# Altium project PLC1.PrjPcb (part 1 of 2)
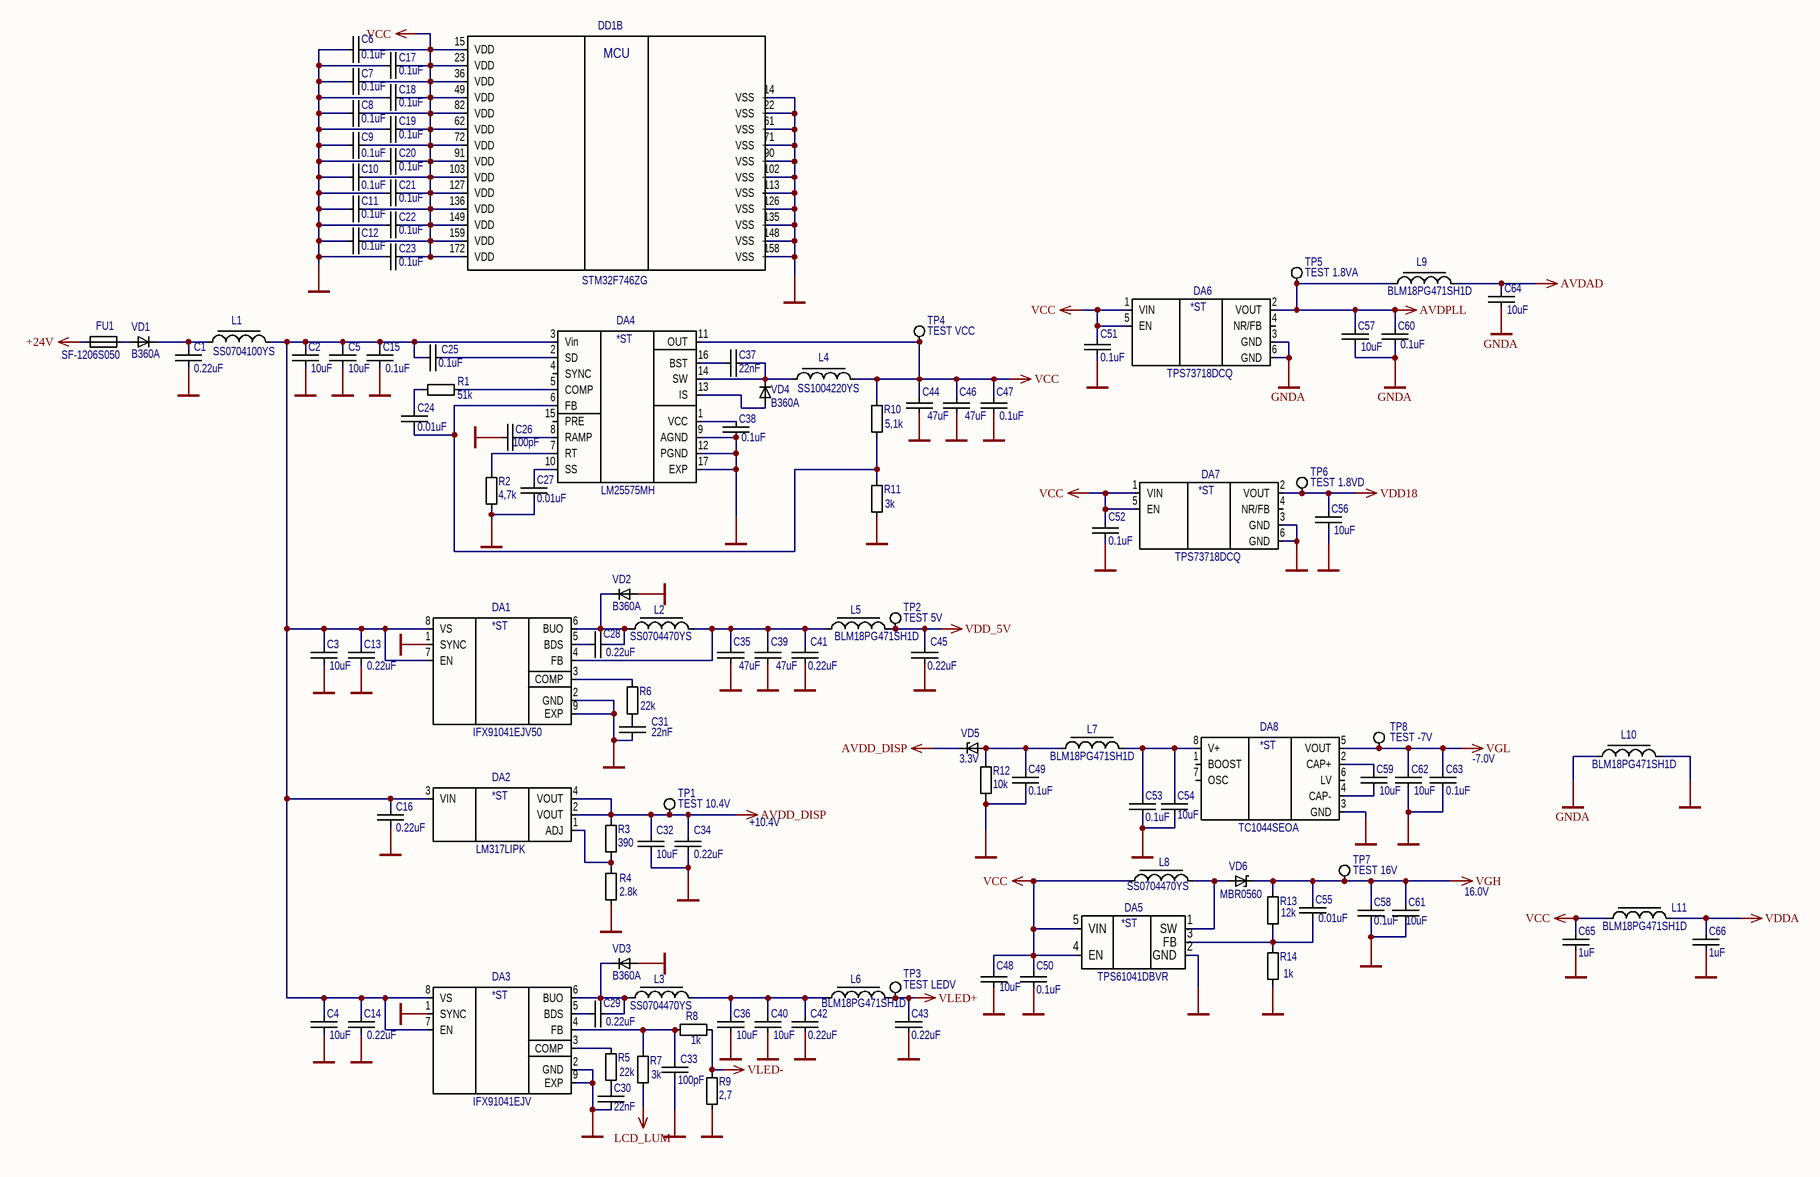
[diagram p0: PLC1.SchDoc]
4 sheets, 347 parts. Net scope: global (net labels, ports and power ports of the same name join across sheets).
Board file: PLC1.PcbDoc
Sheets:
  PLC1.SchDoc
  PLC1_2.SchDoc
  PLC1_3.SchDoc
  PLC1_4.SchDoc

## Sheet PLC1.SchDoc
size 420 x 297 mm; Author: Тертычный; DrawnBy: Тертычный; SheetNumber: 1; SheetTotal: 2; Scale: {Масш.}; Title1str: {Наименование}; PageSetup: Record=PageOptions|CenterHorizontal=False|CenterVertical=False|PrintScale=0.67|XCorrection=0.00|YCorrection=0.00|PrintKind=1|BorderSize=5000000|LeftOffset=0|BottomOffset=0|Orientation=2|PaperLength=2970|PaperWidth=2100|Scale=100|PaperSource=7|PrintQuality=600|MediaType=1|DitherType=10|PaperKind=A4|PrintScaleMode=1; Title2str: {Наименование}; Mass: {Масса}; Letter1Column: {}; Letter2Column: {}; Letter3Column: {}; DocumentType: Панель индикации; DocumentType1str: {Документ}; DocumentType2str: {Документ}

### Parts
C1  value 0.22uF  [C_0805]  (hidden comment: Cap_0805)
C2  value 10uF  [CAP1210]  (hidden comment: Cap_1210)
C3  value 10uF  [CAP1210]  (hidden comment: Cap_1210)
C4  value 10uF  [CAP1210]  (hidden comment: Cap_1210)
C5  value 10uF  [CAP1210]  (hidden comment: Cap_1210)
C6  0.1uF  [CAP_0603]
C7  0.1uF  [CAP_0603]
C8  0.1uF  [CAP_0603]
C9  0.1uF  [CAP_0603]
C10  0.1uF  [CAP_0603]
C11  0.1uF  [CAP_0603]
C12  0.1uF  [CAP_0603]
C13  value 0.22uF  [C_0805]  (hidden comment: Cap_0805)
C14  value 0.22uF  [C_0805]  (hidden comment: Cap_0805)
C15  0.1uF  [C_0805]
C16  value 0.22uF  [C_0805]  (hidden comment: Cap_0805)
C17  0.1uF  [CAP_0603]
C18  0.1uF  [CAP_0603]
C19  0.1uF  [CAP_0603]
C20  0.1uF  [CAP_0603]
C21  0.1uF  [CAP_0603]
C22  0.1uF  [CAP_0603]
C23  0.1uF  [CAP_0603]
C24  0.01uF  [CAP_0603]
C25  0.1uF  [C_0805]
C26  value 100pF  [CAP_0603]  (hidden comment: 100p)
C27  value 0.01uF  [CAP_0603]  (hidden comment: 0.1uF)
C28  value 0.22uF  [C_0805]  (hidden comment: Cap_0805)
C29  value 0.22uF  [C_0805]  (hidden comment: Cap_0805)
C30  22nF  [CAP_0603]
C31  22nF  [CAP_0603]
C32  value 10uF  [CAP1210]  (hidden comment: Cap_1210)
C33  value 100pF  [CAP_0603]  (hidden comment: 100p)
C34  value 0.22uF  [C_0805]  (hidden comment: Cap_0805)
C35  value 47uF  [CAP1206]  (hidden comment: 1206)
C36  value 10uF  [CAP1210]  (hidden comment: Cap_1210)
C37  22nF  [CAP_0603]
C38  0.1uF  [CAP_0603]
C39  value 47uF  [CAP1206]  (hidden comment: 1206)
C40  value 10uF  [CAP1210]  (hidden comment: Cap_1210)
C41  value 0.22uF  [C_0805]  (hidden comment: Cap_0805)
C42  value 0.22uF  [C_0805]  (hidden comment: Cap_0805)
C43  value 0.22uF  [C_0805]  (hidden comment: Cap_0805)
C44  value 47uF  [CAP1206]  (hidden comment: 1206)
C45  value 0.22uF  [C_0805]  (hidden comment: Cap_0805)
C46  value 47uF  [CAP1206]  (hidden comment: 1206)
C47  0.1uF  [CAP_0603]
C48  10uF  [C_0805]
C49  0.1uF  [CAP_0603]
C50  0.1uF  [CAP_0603]
C51  0.1uF  [CAP_0603]
C52  0.1uF  [CAP_0603]
C53  0.1uF  [CAP_0603]
C54  value 10uF  [C_0805]  (hidden comment: Cap_0805)
C55  0.01uF  [CAP_0603]
C56  value 10uF  [C_0805]  (hidden comment: Cap_0805)
C57  value 10uF  [C_0805]  (hidden comment: Cap_0805)
C58  0.1uF  [CAP_0603]
C59  value 10uF  [C_0805]  (hidden comment: Cap_0805)
C60  0.1uF  [CAP_0603]
C61  value 10uF  [CAP1210]  (hidden comment: Cap_1210)
C62  value 10uF  [C_0805]  (hidden comment: Cap_0805)
C63  0.1uF  [CAP_0603]
C64  value 10uF  [C_0805]  (hidden comment: Cap_0805)
C65  1uF  [CAP_0603]
C66  1uF  [CAP_0603]
DA1  IFX91041EJV50  [SO-G8/E3]
DA2  LM317LIPK  [SOT-89]
DA3  IFX91041EJV50  [SO-G8/E3]  (value not drawn)
DA4  LM25575MH  [HTSSO5x6-G16]
DA5  Part Number: TPS61041DBVR  [SOT23-5]  (hidden comment: TPS61041)
DA6  TPS73718DCQ  [SOT-223-6]
DA7  TPS73718DCQ  [SOT-223-6]
DA8  TC1044SEOA  [SOIC8]
DD1  Part Number: STM32F746ZG  [F-QFP24x24-G176/N]  (hidden comment: STM32F746ZG_176)  (part B of 2)
FU1  g  [Res_1206]  (value not drawn)
L1  SS0704100YS  [SS0704]
L2  SS0704470YS  [SS0704]
L3  SS0704470YS  [SS0704]
L4  value SS1004220YS  [SS1004]  (hidden comment: SS1004100YS)
L5  BLM18PG471SH1D  [R_IND_0603]
L6  BLM18PG471SH1D  [R_IND_0603]
L7  BLM18PG471SH1D  [R_IND_0603]
L8  value SS0704470YS  [SS0704]  (hidden comment: SS0704100YS)
L9  BLM18PG471SH1D  [R_IND_0603]
L10  BLM18PG471SH1D  [R_IND_0603]
L11  BLM18PG471SH1D  [R_IND_0603]
R1  51k  [RES_0603]
R2  4,7k  [Res_0603]
R3  390  [RES_0603]
R4  2.8k  [RES_0603]
R5  22k  [RES_0603]
R6  22k  [RES_0603]
R7  3k  [RES_0603]
R8  1k  [RES_0603]
R9  2,7  [RES_0603]
R10  value 5,1k  [RES_0603]  (hidden comment: 5.1k)
R11  3k  [RES_0603]
R12  10k  [RES_0603]
R13  12k  [RES_0603]
R14  1k  [RES_0603]
TP1  value TEST 10.4V  [TEST POINT]  (hidden comment: JUMPER)
TP2  value TEST 5V  [TEST POINT]  (hidden comment: JUMPER)
TP3  value TEST LEDV  [TEST POINT]  (hidden comment: JUMPER)
TP4  value TEST VCC  [TEST POINT]  (hidden comment: JUMPER)
TP5  value TEST 1.8VA  [TEST POINT]  (hidden comment: JUMPER)
TP6  value TEST 1.8VD  [TEST POINT]  (hidden comment: JUMPER)
TP7  value TEST 16V  [TEST POINT]  (hidden comment: JUMPER)
TP8  value TEST -7V  [TEST POINT]  (hidden comment: JUMPER)
VD1  B360A  [DO-214AC]
VD2  B360A  [DO-214AC]
VD3  B360A  [DO-214AC]
VD4  B360A  [DO-214AC]
VD5  3.3V  [SOD-123]
VD6  MBR0560  [SOD-123]

### Nets
+24V: FU1.1
AVDAD: C64.2 L9.1
AVDD_DISP: C32.2 C34.2 DA2.2(VOUT) DA2.4(VOUT) R3.1 TP1.1 VD5.2
AVDPLL: C57.2 C60.1 DA6.2(VOUT) L9.2 TP5.1
GND: C1.1 C2.1 C3.1 C4.1 C5.1 C6.1 C7.2 C8.1 C9.2 C10.1 C11.1 C12.1 C13.1 C14.1 C15.2 C16.1 C17.1 C18.2 C19.2 C20.1 C21.2 C22.1 C23.1 C26.2 C27.1 C30.1 C31.1 C32.1 C33.2 C34.1 C35.1 C36.1 C38.2 C39.1 C40.1 C41.1 C42.1 C43.1 C44.1 C45.1 C46.1 C47.1 C48.1 C49.1 C50.1 C51.1 C52.1 C53.1 C54.1 C56.1 C58.1 C61.1 C62.1 C63.1 C65.1 C66.1 DA1.1(SYNC) DA1.2(GND) DA1.9(EXP) DA3.1(SYNC) DA3.2(GND) DA3.9(EXP) DA4.9(AGND) DA4.12(PGND) DA4.17(EXP) DA5.2(GND) DA7.3(GND) DA7.6(GND) DA8.3(GND) DD1.14(VSS) DD1.22(VSS) DD1.61(VSS) DD1.71(VSS) DD1.90(VSS) DD1.102(VSS) DD1.113(VSS) DD1.126(VSS) DD1.135(VSS) DD1.148(VSS) DD1.158(VSS) L10.1 R2.1 R4.2 R9.2 R11.1 R12.2 R14.2 VD2.1 VD3.1
GNDA: C57.1 C60.2 C64.1 DA6.3(GND) DA6.6(GND) L10.2
LCD_LUM: R7.1
VCC: C6.2 C7.1 C8.2 C9.1 C10.2 C11.2 C12.2 C17.2 C18.1 C19.1 C20.2 C21.1 C22.2 C23.2 C44.2 C46.2 C47.2 C48.2 C50.2 C51.2 C52.2 C65.2 DA4.11(OUT) DA5.4(EN) DA5.5(VIN) DA6.1(VIN) DA6.5(EN) DA7.1(VIN) DA7.5(EN) DD1.15(VDD) DD1.23(VDD) DD1.36(VDD) DD1.49(VDD) DD1.62(VDD) DD1.72(VDD) DD1.82(VDD) DD1.91(VDD) DD1.103(VDD) DD1.127(VDD) DD1.136(VDD) DD1.149(VDD) DD1.159(VDD) DD1.172(VDD) L4.1 L8.2 L11.2 R10.2 TP4.1
VDD18: C56.2 DA7.2(VOUT) TP6.1
VDD_5V: C45.2 L5.1 TP2.1
VDDA: C66.2 L11.1
VGH: C55.2 C58.2 C61.2 R13.1 TP7.1 VD6.2
VGL: C62.2 C63.2 DA8.5(VOUT) TP8.1
VLED+: C43.2 L6.1 TP3.1
VLED-: R8.2 R9.1
NetC1_2: C1.2 L1.2 VD1.2
NetC2_2: C2.2 C3.2 C4.2 C5.2 C13.2 C14.2 C15.1 C16.2 C25.2 DA1.7(EN) DA1.8(VS) DA2.3(VIN) DA3.7(EN) DA3.8(VS) DA4.3(Vin) L1.1
NetC24_1: C24.1 DA4.6(FB) R10.1 R11.2
NetC24_2: C24.2 R1.1
NetC25_1: C25.1 DA4.2(SD)
NetC26_1: C26.1 DA4.8(RAMP)
NetC27_2: C27.2 DA4.10(SS)
NetC28_1: C28.1 DA1.6(BUO) L2.2 VD2.2
NetC28_2: C28.2 DA1.5(BDS)
NetC29_1: C29.1 DA3.6(BUO) L3.2 VD3.2
NetC29_2: C29.2 DA3.5(BDS)
NetC30_2: C30.2 R5.1
NetC31_2: C31.2 R6.1
NetC33_1: C33.1 DA3.4(FB) R7.2 R8.1
NetC35_2: C35.2 C39.2 C41.2 DA1.4(FB) L2.1 L5.2
NetC36_2: C36.2 C40.2 C42.2 L3.1 L6.2
NetC37_1: C37.1 DA4.16(BST)
NetC37_2: C37.2 DA4.14(SW) L4.2 VD4.2
NetC38_1: C38.1 DA4.1(VCC)
NetC49_2: C49.2 L7.2 R12.1 VD5.1
NetC53_2: C53.2 C54.2 DA8.8(V+) L7.1
NetC55_1: C55.1 DA5.3(FB) R13.2 R14.1
NetC59_1: C59.1 DA8.4(CAP-)
NetC59_2: C59.2 DA8.2(CAP+)
NetDA1_3: DA1.3(COMP) R6.2
NetDA2_1: DA2.1(ADJ) R3.2 R4.1
NetDA3_3: DA3.3(COMP) R5.2
NetDA4_5: DA4.5(COMP) R1.2
NetDA4_7: DA4.7(RT) R2.2
NetDA4_13: DA4.13(IS) VD4.1
NetDA5_1: DA5.1(SW) L8.1 VD6.1
NetFU1_2: FU1.2 VD1.1

Not connected (* = marked no-connect by the designer): DA4 4(SYNC) 15(PRE); DA6 4(NR/FB); DA7 4(NR/FB); DA8 1(BOOST) 6(LV) 7(OSC)

### Notes on the sheet
- (near C63) -7.0V
- +10.4V
- 16.0V
- Перв. примен.
- Справ. №
- Подп. и дата
- Инв. № дубл.
- Взам. инв. №
- Разраб.
- Изм.
- Лист
- № докум.
- Подп.
- Дата
- Лит.
- Масса
- Масштаб
- Пров.
- Т.контр.
- Листов
- Инв. № подл.
- Утв.
- Н.контр.
- 2.106-A3
- Копировал
- Формат А3
- (in symbol IFX91041EJV33) *ST
- (in symbol LM317LIPK) *ST
- (in symbol LM25575MH) *ST
- (in symbol TC1044SEOA) *ST
- (in symbol TPS61041) *ST
- (in symbol TPS73718DCQ) *ST

### Library data of the parts
C1 C16 C34 = Cap_0805: Manufacturer: KEMET; Part Number: C0805C224K5RACTU; Replacement: 0805 X7R 50V 0.22uF; Price: 0.01$
C2 C5 C32 C61 = Cap_1210: Manufacturer: MURATA; Part Number: GRM31CR61H106KA12L; Replacement: 1210 10uF X5R or X7R 50V; PackageReference: 1210; Distributor: http://chipdip.ru/; Price: 0.2$
C3 C4 C36 C40 = Cap_1210: Manufacturer: MURATA; Part Number: GRM31CR61H106KA12L; Replacement: 1210 10uF X5R or X7R; PackageReference: 1210; Distributor: http://chipdip.ru/; Price: 0.2$
C6-C12 C17-C23 = Cap_0603: Manufacturer: AVX; Part Number: 0603YC104KAT2A; Replacement: GRM188R71E104KA12D; PackageReference: 0603; Value: 0.1uF; Distributor: http://www.rospek.ru; Price: 0.001$
C13 C14 C28 C29 C41-C43 C45 = Cap_0805: Part Number: C0805C224K5RACTU; Replacement: 0805 X7R 50V 0.22uF
C15 C25 = Cap_0805: Manufacturer: KEMET; Part Number: C0805C104K5RACTU; Replacement: 0805 X7R 50V 0.22uF; PackageReference: 0805; Value: 0.1uF; Price: 0.001$
C24 C27 C55 = Cap_0603: Manufacturer: AVX; Part Number: 0603YC103KAT2A; Replacement: GRM188R71E103KA12D; PackageReference: 0603; Distributor: http://www.rospek.ru; Price: 0.001$
  C24 C55: Value: 0.01uF
C26 C33 = Cap_0603: Manufacturer: Yageo; Part Number: CC0603JRNPO9BN101; Replacement: 100pF 0603 NP0; PackageReference: 0603; Distributor: http://www.platan.ru/; Price: 0.02$
C30 C31 C37 = Cap_0603: 10% X7R 0603; Manufacturer: Yageo; Part Number: CC0603KRX7R9BB223; Replacement: 22 nF 50V X7R 10% 0603; PackageReference: 0603; Value: 22nF; Distributor: http://www.rospek.ru; Price: 0.01$
C35 C39 C44 C46 = Cap_1206: Manufacturer: Murata; Part Number: GRM31CR61A476KE15L; Replacement: 1206 47uF 10V X5R; PackageReference: 1206
C38 C47 C49-C53 C58 C60 C63 = Cap_0603: 16V 0.1uF 10% X7R; Manufacturer: AVX; Part Number: 0603YC104KAT2A; Replacement: 0.1uF 16V X7R 10% 0603; PackageReference: 0603; Value: 0.1uF; Distributor: http://www.rospek.ru; Price: 0.001$
C48 C54 C56 C57 C59 C62 C64 = Cap_0805: Manufacturer: Murata; Part Number: GRM21BR61E106KA73L; Replacement: 0805 16V X7R; PackageReference: 0805; Price: 0.01$
  C48: Value: 10uF
C65 C66 = Cap_0603: Manufacturer: AVX; Part Number: 0603YC105KAT2A; Replacement: 0603YD105KAT2A; PackageReference: 0603; Value: 1uF; Distributor: http://www.rospek.ru; Price: 0.001$
DA1 = IFX91041EJV33: Manufacturer: Infenion; Price: 1.0$; Distributor: infenion.com; Replacement: IFX91041EJV50; PackageReference: PG-DSO-8-27; Part Number: IFX91041EJV50
DA2 = LM317LIPK: Manufacturer: Texas Instruments; Price: 0.1$; Distributor: TI; Replacement: LM317LIPK; PackageReference: SOT-89; Part Number: LM317LIPK
DA3 = IFX91041EJV33: IFX91041EJV; Manufacturer: Infenion; Replacement: IFX91041EJV ADJUST; Price: 0.78$; Distributor: infenion.com; PackageReference: PG-DSO-8-27; Part Number: IFX91041EJV
DA4 = LM25575MH: Manufacturer: Infenion; Replacement: LM25575QMHX; Price: 3.0$; Distributor: infenion.com; PackageReference: HTSSOP-16; Part Number: LM25575MH
DA5 = TPS61041: TPS61041 step-Up; Manufacturer: Texas Instruments; Price: 04$; Distributor: http://www.compel.ru/; PackageReference: SOT-23-5
DA6 DA7 = TPS73718DCQ: Manufacturer: Texas Instruments; Price: 0.1$; Distributor: TI; Replacement: TPS73718DCQ; PackageReference: SOT-89; Part Number: TPS73718DCQ
DA8 = TC1044SEOA: Manufacturer: MICROCHIP; Price: 0.7$; Distributor: chipdip.ru; Replacement: TC1044SEOA; PackageReference: SOIC-8; Part Number: TC1044SEOA
DD1 = STM32F746ZG_176: MCU; Manufacturer: ST; Price: 15$; Distributor: mouser; Replacement: STM32F746; PackageReference: LQFP144
FU1 = SF-1206S050: Fuse 0.5A; Manufacturer: Bourns; Replacement: 1206 fuse 0.5A; Part Number: SF-1206S050
L1 L8 = SS0704100YS: Manufacturer: ABC; Replacement: 10uH SS070; Part Number: SS0704100YS; Distributor: http://www.chipdip.ru; Price: 1$
  L1: Value: SS0704100YS
L2 L3 = SS0704100YS: Manufacturer: ABC; Replacement: 47uH SS070; Part Number: SS0704470YS; Distributor: http://www.chipdip.ru; Price: 1$; Value: SS0704470YS
L4 = SS1004470YS: Manufacturer: ABC; Replacement: 22uH; PackageReference: SS1004; Part Number: SS1004220YS; Distributor: http://www.chipdip.ru; Price: 1$
L5-L7 L9-L11 = FCM1608KF-601T03: Manufacturer: Murata; Replacement: 600 ohm @100 MHz; PackageReference: 0603; Part Number: BLM18PG471SH1D; Distributor: http://www.chipdip.ru; Price: 0.1$; Value: BLM18PG471SH1D
R1 = Res_0603: 0603, 51k; Manufacturer: Vishay; Part Number: CRCW0603-513JRT1; Replacement: 0603 51 kOhm 5%; PackageReference: 0603; Distributor: http://www.kontest.ru; Price: 0.01$
R2 = Res_0603: 0603, 100; Manufacturer: Vishay; Part Number: CRCW0603-472JRT1; Replacement: 0603 4.7 kOhm 5%; PackageReference: 0603; Value: 4,7k; Distributor: http://www.kontest.ru; Price: 0.01$
R3 = Res_0603: 0603, 390; Manufacturer: Vishay; Part Number: CRCW0603390RFKEA; Replacement: 0603 390 1%; PackageReference: 0603; Value: 390; Price: 0.004$
R4 = Res_0603: 0603, 390; Manufacturer: Vishay; Part Number: CRCW06032K80FKTA; Replacement: 0603 2.8k 1%; PackageReference: 0603; Value: 2.8k; Price: 0.004$
R5 R6 = Res_0603: 0603; Manufacturer: Yageo; Part Number: RC0603JR-0722K; Replacement: 0603 22 kOhm 5%; PackageReference: 0603; Distributor: http://www.kontest.ru; Price: 0.01$; Value: 22k
R7 R11 = Res_0603: 0603; Manufacturer: Yageo; Part Number: RC0603FR-073KL; Replacement: 0603 3 kOhm 1%; PackageReference: 0603; Distributor: http://www.kontest.ru; Price: 0.01$; Value: 3k
R8 R14 = Res_0603: 0603; Manufacturer: VKING; Part Number: RC0603FR-071KL; Replacement: 0603 1 kOhm 1%; PackageReference: 0603; Value: 1k; Distributor: http://www.kontest.ru; Price: 0.001$
R9 = Res_0805: 0603 2.7 Ohm 1% 0.125W; Manufacturer: Vishay; Part Number: CR0603-J/-2R7GLF; Replacement: 2.7 Ohm 0603; Value: 2.7; PackageReference: 0603; Distributor: http://www.kontest.ru; Price: 0.01$
R10 = Res_0603: 0603, 5.1k; Manufacturer: Yageo; Part Number: RC0603JR-075K1L; Replacement: 0603 5.1 kOhm 1%; PackageReference: 0603; Distributor: http://www.kontest.ru; Price: 0.01$
R12 = Res_0603: 0603, 10k; Manufacturer: Vishay; Part Number: CRCW060310K0JNE; Replacement: 0603 10 kOhm 5%; PackageReference: 0603; Distributor: http://www.kontest.ru; Price: 0.01$; Value: 10k
R13 = Res_0603: 0603; Manufacturer: Vishay; Part Number: CRCW060312K0FKEA; Replacement: 0603 12 kOhm 1%; PackageReference: 0603; Value: 12k; Distributor: http://www.kontest.ru; Price: 0.001$
TP1-TP8 = TEST_POINT_SMALL: JUMPER 2.54; Manufacturer: TE; Price: 0.05$
VD1-VD4 = S1A: Manufacturer: VISHAY; Price: 3; Distributor: http://www.chipdip.ru/; Part Number: B360A; PackageReference: DO-214AC
VD5 = BZT52-C3V3S: Price: 0.2$; Distributor: http://www.chipdip.ru/; Part Number: BZT52-C3V3S; PackageReference: SOD-223; Replacement: BZT52-C3V3S
VD6 = MBR0560: Price: 0.2$; Distributor: http://www.chipdip.ru/; Part Number: MBR0560; Replacement: MBR0560; PackageReference: SOD-123

## Sheet PLC1_2.SchDoc
size 420 x 297 mm; SheetNumber: 2; Scale: {Масш.}; Title1str: {Наименование}; PageSetup: Record=PageOptions|CenterHorizontal=False|CenterVertical=False|PrintScale=0.70|XCorrection=0.00|YCorrection=0.00|PrintKind=1|BorderSize=5000000|LeftOffset=0|BottomOffset=0|Orientation=2|PaperLength=1000|PaperWidth=1000|Scale=100|PaperSource=7|PrintQuality=600|MediaType=1|DitherType=10|PrintScaleMode=1|PaperKind=A4; Title2str: {Наименование}; ProcessInspection: {Т.контр.}; Mass: {Масса}; NormInspection: {Н.контр.}; EngineerName: {Инженер}; Letter1Column: {}; Letter2Column: {}; Letter3Column: {}; DocumentType: ?????????????? ?????; DocumentType1str: {Документ}; DocumentType2str: {Документ}
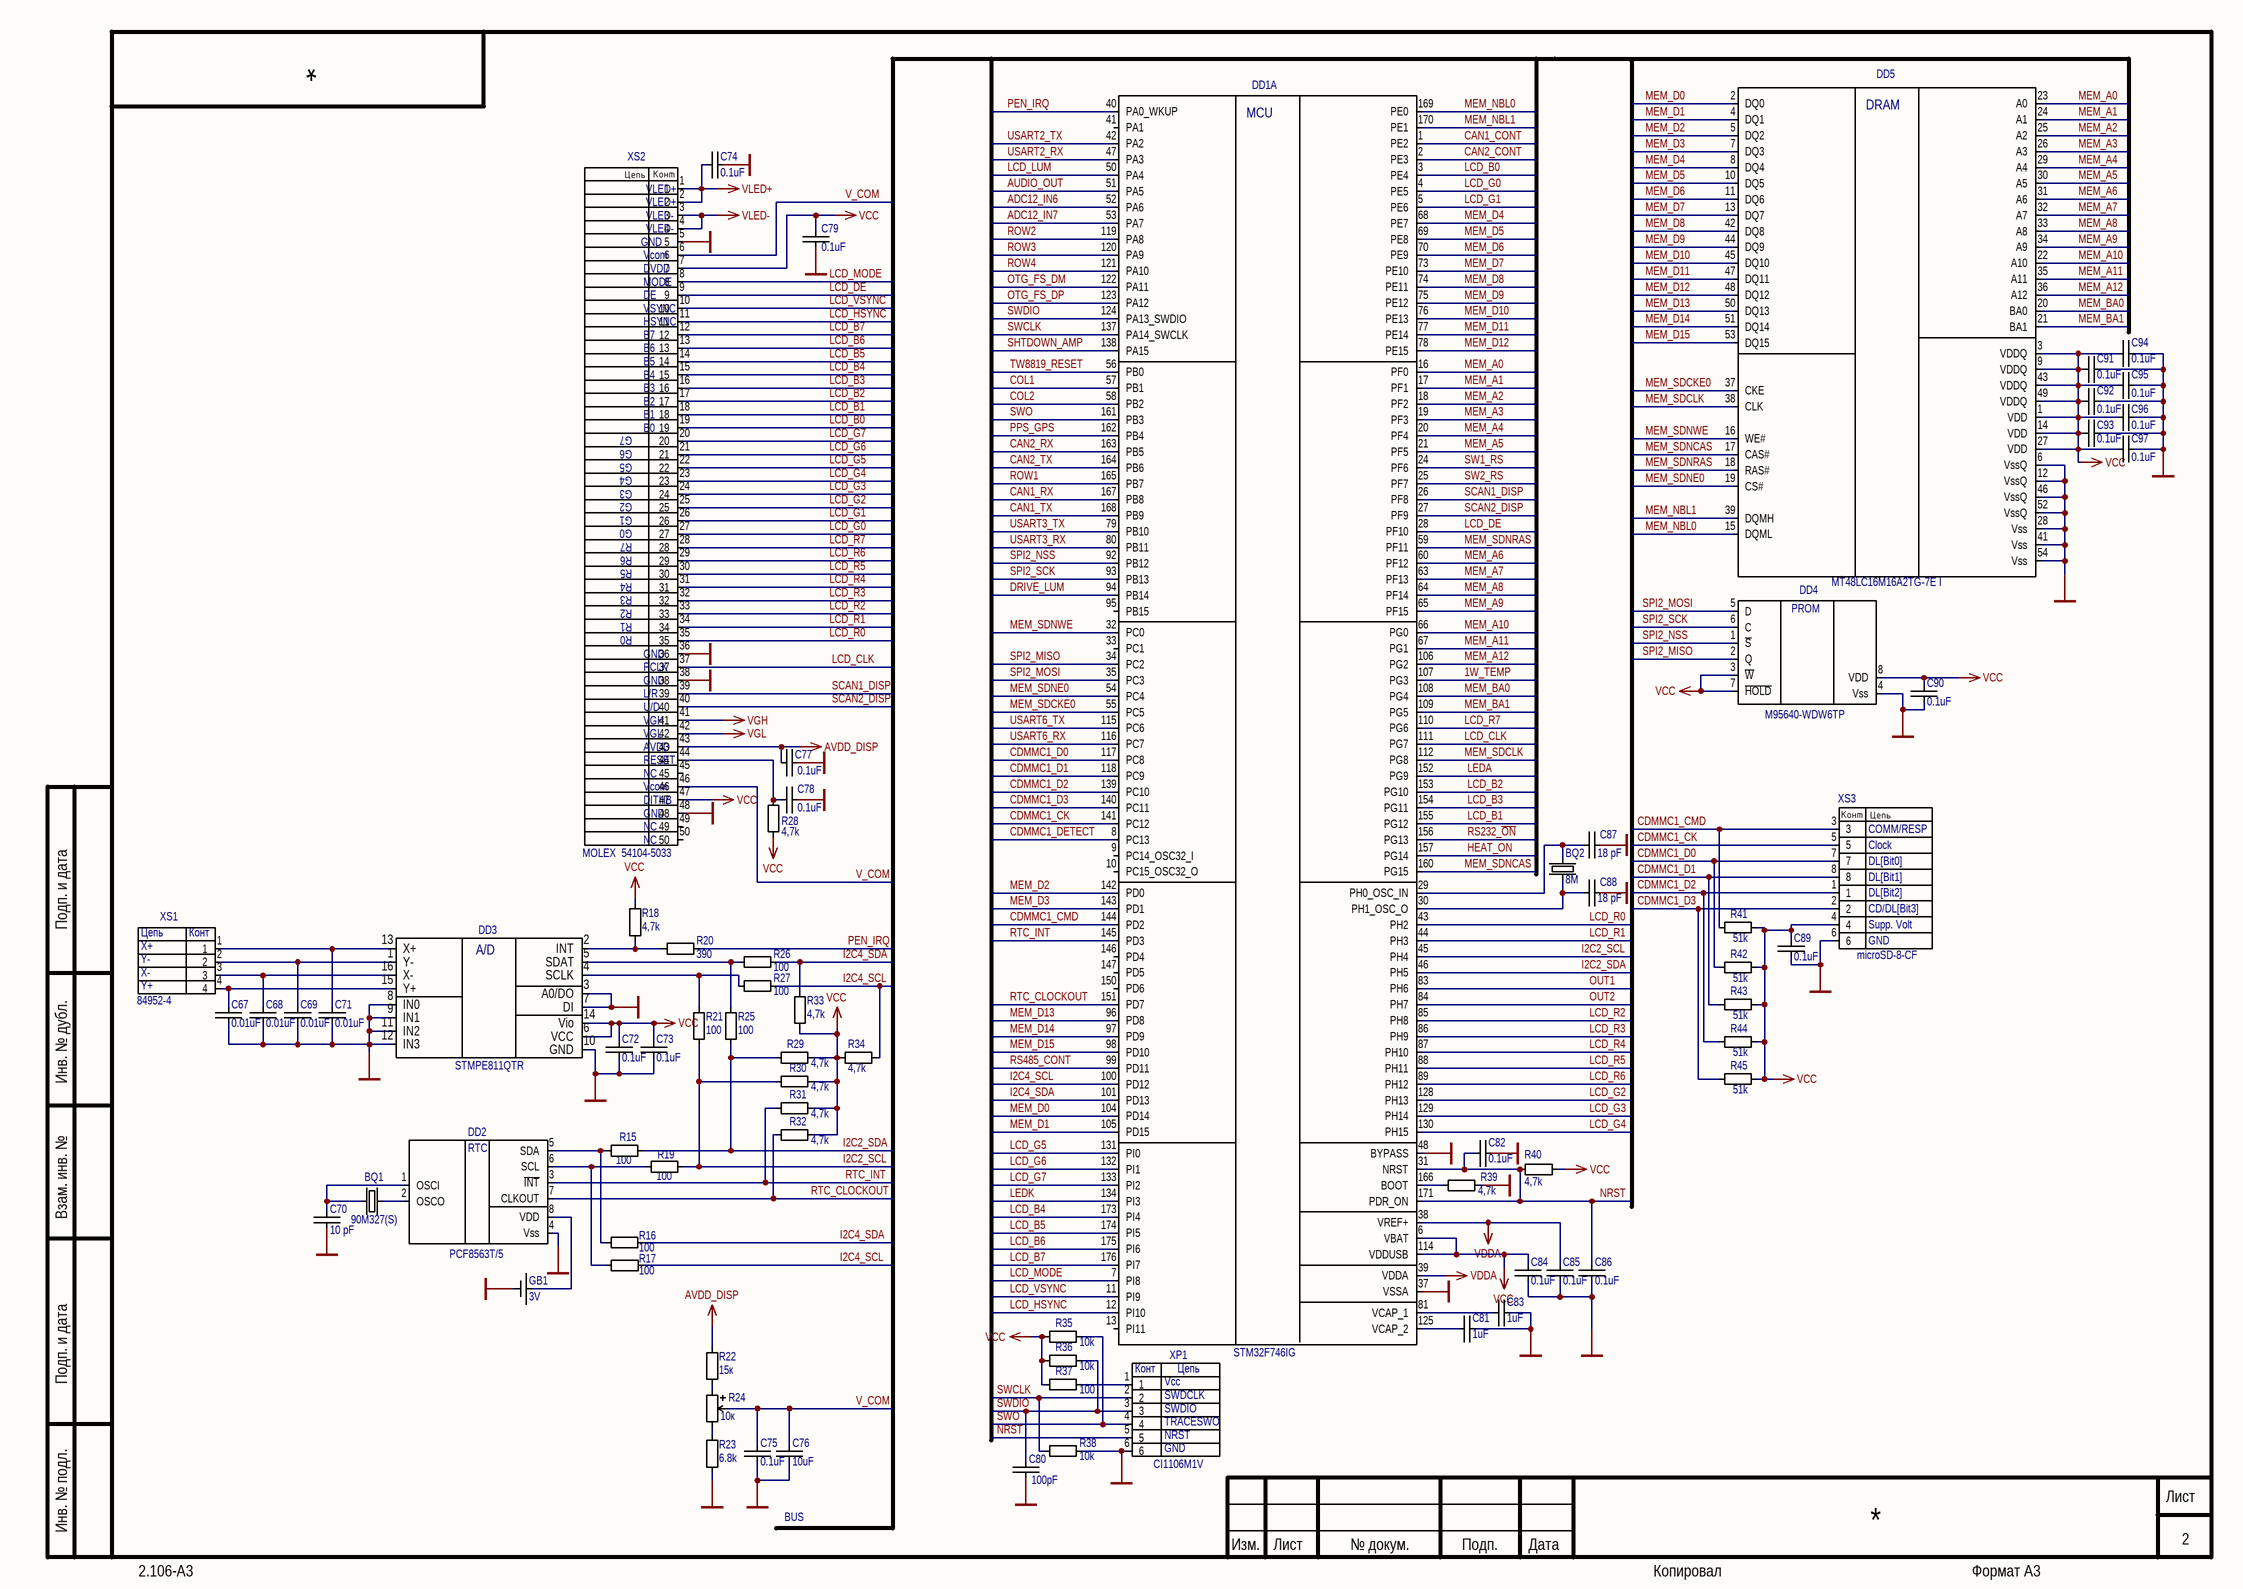
[diagram p1: PLC1_2.SchDoc]

### Parts
BQ1  Part Number: 90M327(S)  [90SMX]  (hidden comment: 90SMX 32768)
BQ2  value 8M  [TSX-3225]  (hidden comment: TSX-3225)
C67  0.01uF  [CAP_0603]
C68  0.01uF  [CAP_0603]
C69  0.01uF  [CAP_0603]
C70  value 10 pF  [CAP_0603]  (hidden comment: 10pF)
C71  0.01uF  [CAP_0603]
C72  0.1uF  [CAP_0603]
C73  0.1uF  [CAP_0603]
C74  0.1uF  [CAP_0603]
C75  0.1uF  [CAP_0603]
C76  value 10uF  [C_0805]  (hidden comment: Cap_0805)
C77  0.1uF  [CAP_0603]
C78  0.1uF  [CAP_0603]
C79  0.1uF  [CAP_0603]
C80  value 100pF  [CAP_0603]  (hidden comment: 100p)
C81  1uF  [CAP_0603]
C82  0.1uF  [CAP_0603]
C83  1uF  [CAP_0603]
C84  0.1uF  [CAP_0603]
C85  0.1uF  [CAP_0603]
C86  0.1uF  [CAP_0603]
C87  value 18 pF  [CAP_0603]  (hidden comment: 18pF)
C88  value 18 pF  [CAP_0603]  (hidden comment: 18pF)
C89  0.1uF  [CAP_0603]
C90  0.1uF  [CAP_0603]
C91  0.1uF  [CAP_0603]
C92  0.1uF  [CAP_0603]
C93  0.1uF  [CAP_0603]
C94  0.1uF  [CAP_0603]
C95  0.1uF  [CAP_0603]
C96  0.1uF  [CAP_0603]
C97  0.1uF  [CAP_0603]
DD1  Part Number: STM32F746IG  [F-QFP24x24-G176/N]  (hidden comment: STM32F746ZG_176)  (part A of 2)
DD2  Part Number: PCF8563T/5  [SOIC8]  (hidden comment: PCF8563_SOIC8)
DD3  STMPE811QTR  [QFN3X3-16]
DD4  Part Number: M95640-WDW6TP  [TSSO3x5-G8/X.4]  (hidden comment: M95640-WDW6TP_TSSOP-8)
DD5  Part Number: MT48LC16M16A2TG-7E I  [TSOP-54]  (hidden comment: MT48LC16M16A2TG)
GB1  3V  [Keystone-1066]
R15  value 100  [RES_0402]  (hidden comment: Res_0402)
R16  value 100  [RES_0402]  (hidden comment: Res_0402)
R17  value 100  [RES_0402]  (hidden comment: Res_0402)
R18  4,7k  [Res_0603]
R19  value 100  [RES_0402]  (hidden comment: Res_0402)
R20  390  [RES_0603]
R21  value 100  [RES_0402]  (hidden comment: Res_0402)
R22  15к  [RES_0603]
R23  6.8k  [RES_0603]
R24  value 10к  [3302X -3-103E]
R25  value 100  [RES_0402]  (hidden comment: Res_0402)
R26  value 100  [RES_0402]  (hidden comment: Res_0402)
R27  value 100  [RES_0402]  (hidden comment: Res_0402)
R28  4,7k  [Res_0603]
R29  4,7k  [Res_0603]
R30  4,7k  [Res_0603]
R31  4,7k  [Res_0603]
R32  4,7k  [Res_0603]
R33  4,7k  [Res_0603]
R34  4,7k  [Res_0603]
R35  10k  [RES_0603]
R36  10k  [RES_0603]
R37  value 100  [RES_0402]  (hidden comment: Res_0402)
R38  10k  [RES_0603]
R39  4,7k  [Res_0603]
R40  4,7k  [Res_0603]
R41  51k  [RES_0603]
R42  51k  [RES_0603]
R43  51k  [RES_0603]
R44  51k  [RES_0603]
R45  51k  [RES_0603]
XP1  value CI1106M1V  [CI1106М1V]
XS1  84952-4  [100ZFS-RL-04 Type2]
XS2  MOLEX  54104-5033  [FB0.5-50]
XS3  microSD-8-CF  [microSD-8-cf]

### Nets
AVDD_DISP: C77.1 R22.1 XS2.43
GND: C67.2 C68.2 C69.2 C70.1 C71.2 C72.1 C73.1 C74.1 C75.2 C76.1 C77.2 C78.2 C79.1 C80.2 C81.2 C82.2 C83.2 C84.2 C85.2 C86.2 C87.1 C88.1 C89.2 C90.2 C91.2 C92.1 C93.2 C94.2 C95.1 C96.2 C97.1 DD1.37(VSSA) DD1.48(BYPASS) DD2.4(Vss) DD3.3(A0/DO) DD3.7(DI) DD3.8(IN0) DD3.9(IN1) DD3.10(GND) DD3.11(IN2) DD3.12(IN3) DD4.4(Vss) DD5.6(VssQ) DD5.12(VssQ) DD5.28(Vss) DD5.41(Vss) DD5.46(VssQ) DD5.52(VssQ) DD5.54(Vss) GB1.1 R23.2 R38.1 R39.2 XP1.6 XS2.5 XS2.36 XS2.38 XS2.48 XS3.6
LCD_LUM: DD1.50(PA4)
VCC: C72.2 C73.2 C79.2 C84.1 C89.1 C90.1 C91.1 C92.2 C93.1 C94.1 C95.2 C96.1 C97.2 DD1.6(VBAT) DD1.114(VDDUSB) DD3.6(VCC) DD3.14(Vio) DD4.3(~{W}) DD4.7(~{HOLD}) DD4.8(VDD) DD5.1(VDD) DD5.3(VDDQ) DD5.9(VDDQ) DD5.14(VDD) DD5.27(VDD) DD5.43(VDDQ) DD5.49(VDDQ) R18.2 R28.1 R29.2 R30.2 R31.2 R32.2 R33.2 R34.1 R35.2 R36.2 R37.2 R40.2 R41.1 R42.1 R43.1 R44.1 R45.1 XS2.7 XS2.47 XS3.4
VDDA: C85.1 DD1.38(VREF+) DD1.39(VDDA)
VGH: XS2.41
VGL: XS2.42
VLED+: C74.2 XS2.1 XS2.2
VLED-: XS2.3 XS2.4
1W_TEMP: DD1.107(PG3)
ADC12_IN6: DD1.52(PA6)
ADC12_IN7: DD1.53(PA7)
AUDIO_OUT: DD1.51(PA5)
CAN1_CONT: DD1.1(PE2)
CAN1_RX: DD1.167(PB8)
CAN1_TX: DD1.168(PB9)
CAN2_CONT: DD1.2(PE3)
CAN2_RX: DD1.163(PB5)
CAN2_TX: DD1.164(PB6)
CDMMC1_CK: DD1.141(PC12) XS3.5
CDMMC1_CMD: DD1.144(PD2) R41.2 XS3.3
CDMMC1_D0: DD1.117(PC8) R42.2 XS3.7
CDMMC1_D1: DD1.118(PC9) R43.2 XS3.8
CDMMC1_D2: DD1.139(PC10) R44.2 XS3.1
CDMMC1_D3: DD1.140(PC11) R45.2 XS3.2
CDMMC1_DETECT: DD1.8(PC13)
COL1: DD1.57(PB1)
COL2: DD1.58(PB2)
DRIVE_LUM: DD1.94(PB14)
HEAT_ON: DD1.157(PG14)
I2C2_SCL: DD1.45(PH4) R19.2 R21.2 R30.1
I2C2_SDA: DD1.46(PH5) R15.2 R25.2 R29.1
I2C4_SCL: DD1.100(PD12) R17.2 R27.2 R34.2
I2C4_SDA: DD1.101(PD13) R16.2 R26.2 R33.1
LCD_B0: DD1.3(PE4) XS2.19
LCD_B1: DD1.155(PG12) XS2.18
LCD_B2: DD1.153(PG10) XS2.17
LCD_B3: DD1.154(PG11) XS2.16
LCD_B4: DD1.173(PI4) XS2.15
LCD_B5: DD1.174(PI5) XS2.14
LCD_B6: DD1.175(PI6) XS2.13
LCD_B7: DD1.176(PI7) XS2.12
LCD_CLK: DD1.111(PG7) XS2.37
LCD_DE: DD1.28(PF10) XS2.9
LCD_G0: DD1.4(PE5) XS2.27
LCD_G1: DD1.5(PE6) XS2.26
LCD_G2: DD1.128(PH13) XS2.25
LCD_G3: DD1.129(PH14) XS2.24
LCD_G4: DD1.130(PH15) XS2.23
LCD_G5: DD1.131(PI0) XS2.22
LCD_G6: DD1.132(PI1) XS2.21
LCD_G7: DD1.133(PI2) XS2.20
LCD_HSYNC: DD1.12(PI10) XS2.11
LCD_MODE: DD1.7(PI8) XS2.8
LCD_R0: DD1.43(PH2) XS2.35
LCD_R1: DD1.44(PH3) XS2.34
LCD_R2: DD1.85(PH8) XS2.33
LCD_R3: DD1.86(PH9) XS2.32
LCD_R4: DD1.87(PH10) XS2.31
LCD_R5: DD1.88(PH11) XS2.30
LCD_R6: DD1.89(PH12) XS2.29
LCD_R7: DD1.110(PG6) XS2.28
LCD_VSYNC: DD1.11(PI9) XS2.10
LEDA: DD1.152(PG9)
LEDK: DD1.134(PI3)
MEM_A0: DD1.16(PF0) DD5.23(A0)
MEM_A1: DD1.17(PF1) DD5.24(A1)
MEM_A2: DD1.18(PF2) DD5.25(A2)
MEM_A3: DD1.19(PF3) DD5.26(A3)
MEM_A4: DD1.20(PF4) DD5.29(A4)
MEM_A5: DD1.21(PF5) DD5.30(A5)
MEM_A6: DD1.60(PF12) DD5.31(A6)
MEM_A7: DD1.63(PF13) DD5.32(A7)
MEM_A8: DD1.64(PF14) DD5.33(A8)
MEM_A9: DD1.65(PF15) DD5.34(A9)
MEM_A10: DD1.66(PG0) DD5.22(A10)
MEM_A11: DD1.67(PG1) DD5.35(A11)
MEM_A12: DD1.106(PG2) DD5.36(A12)
MEM_BA0: DD1.108(PG4) DD5.20(BA0)
MEM_BA1: DD1.109(PG5) DD5.21(BA1)
MEM_D0: DD1.104(PD14) DD5.2(DQ0)
MEM_D1: DD1.105(PD15) DD5.4(DQ1)
MEM_D2: DD1.142(PD0) DD5.5(DQ2)
MEM_D3: DD1.143(PD1) DD5.7(DQ3)
MEM_D4: DD1.68(PE7) DD5.8(DQ4)
MEM_D5: DD1.69(PE8) DD5.10(DQ5)
MEM_D6: DD1.70(PE9) DD5.11(DQ6)
MEM_D7: DD1.73(PE10) DD5.13(DQ7)
MEM_D8: DD1.74(PE11) DD5.42(DQ8)
MEM_D9: DD1.75(PE12) DD5.44(DQ9)
MEM_D10: DD1.76(PE13) DD5.45(DQ10)
MEM_D11: DD1.77(PE14) DD5.47(DQ11)
MEM_D12: DD1.78(PE15) DD5.48(DQ12)
MEM_D13: DD1.96(PD8) DD5.50(DQ13)
MEM_D14: DD1.97(PD9) DD5.51(DQ14)
MEM_D15: DD1.98(PD10) DD5.53(DQ15)
MEM_NBL0: DD1.169(PE0) DD5.15(DQML)
MEM_NBL1: DD1.170(PE1) DD5.39(DQMH)
MEM_SDCKE0: DD1.55(PC5) DD5.37(CKE)
MEM_SDCLK: DD1.112(PG8) DD5.38(CLK)
MEM_SDNCAS: DD1.160(PG15) DD5.17(CAS#)
MEM_SDNE0: DD1.54(PC4) DD5.19(CS#)
MEM_SDNRAS: DD1.59(PF11) DD5.18(RAS#)
MEM_SDNWE: DD1.32(PC0) DD5.16(WE#)
NRST: C82.1 C86.1 DD1.31(NRST) DD1.171(PDR_ON) R40.1 XP1.5
OTG_FS_DM: DD1.122(PA11)
OTG_FS_DP: DD1.123(PA12)
OUT1: DD1.83(PH6)
OUT2: DD1.84(PH7)
PEN_IRQ: DD1.40(PA0_WKUP) R20.2
PPS_GPS: DD1.162(PB4)
ROW1: DD1.165(PB7)
ROW2: DD1.119(PA8)
ROW3: DD1.120(PA9)
ROW4: DD1.121(PA10)
RS232_~{ON}: DD1.156(PG13)
RS485_CONT: DD1.99(PD11)
RTC_CLOCKOUT: DD1.151(PD7) DD2.7(CLKOUT) R32.1
RTC_INT: DD1.145(PD3) DD2.3(~{INT}) R31.1
SCAN1_DISP: DD1.26(PF8) XS2.39
SCAN2_DISP: DD1.27(PF9) XS2.40
SHTDOWN_AMP: DD1.138(PA15)
SPI2_MISO: DD1.34(PC2) DD4.2(Q)
SPI2_MOSI: DD1.35(PC3) DD4.5(D)
SPI2_NSS: DD1.92(PB12) DD4.1(~{S})
SPI2_SCK: DD1.93(PB13) DD4.6(C)
SW1_RS: DD1.24(PF6)
SW2_RS: DD1.25(PF7)
SWCLK: DD1.137(PA14_SWCLK) R38.2 XP1.2
SWDIO: C80.1 DD1.124(PA13_SWDIO) R36.1 XP1.3
SWO: DD1.161(PB3) R35.1 XP1.4
TW8819_RESET: DD1.56(PB0)
USART2_RX: DD1.47(PA3)
USART2_TX: DD1.42(PA2)
USART3_RX: DD1.80(PB11)
USART3_TX: DD1.79(PB10)
USART6_RX: DD1.116(PC7)
USART6_TX: DD1.115(PC6)
V_COM: C75.1 C76.2 R24.2 XS2.6 XS2.46
NetBQ1_1: BQ1.1 C70.2 DD2.1(OSCI)
NetBQ1_2: BQ1.2 DD2.2(OSCO)
NetBQ2_1: BQ2.1 C88.2 DD1.30(PH1_OSC_O)
NetBQ2_2: BQ2.2 C87.2 DD1.29(PH0_OSC_IN)
NetC67_1: C67.1 DD3.15(Y+) XS1.4
NetC68_1: C68.1 DD3.16(X-) XS1.3
NetC69_1: C69.1 DD3.1(Y-) XS1.2
NetC71_1: C71.1 DD3.13(X+) XS1.1
NetC78_1: C78.1 R28.2 XS2.44
NetC81_1: C81.1 DD1.125(VCAP_2)
NetC83_1: C83.1 DD1.81(VCAP_1)
NetDD1_166: DD1.166(BOOT) R39.1
NetDD2_5: DD2.5(SDA) R15.1 R16.1
NetDD2_6: DD2.6(SCL) R17.1 R19.1
NetDD2_8: DD2.8(VDD) GB1.2
NetDD3_2: DD3.2(INT) R18.1 R20.1
NetDD3_4: DD3.4(SCLK) R21.1 R27.1
NetDD3_5: DD3.5(SDAT) R25.1 R26.1
NetR22_2: R22.2 R24.3
NetR23_1: R23.1 R24.1
NetR37_1: R37.1 XP1.1

Not connected (* = marked no-connect by the designer): DD1 9(PC14_OSC32_I) 10(PC15_OSC32_O) 13(PI11) 33(PC1) 41(PA1) 95(PB15) 146(PD4) 147(PD5) 150(PD6); XS2 45 49 50

### Notes on the sheet
- (near XS2) VLED+
- (near XS2) GND
- (near XS2) Vcom
- (near XS2) VLED-
- (near XS2) DVDD
- (near XS2) B7
- (near XS2) HSYNC
- (near XS2) VSYNC
- (near XS2) MODE
- (near XS2) DE
- (near XS2) B2
- (near XS2) B3
- (near XS2) B4
- (near XS2) B5
- (near XS2) B6
- (near XS2) G5
- (near XS2) G6
- (near XS2) G7
- (near XS2) B0
- (near XS2) B1
- (near XS2) G0
- (near XS2) G1
- (near XS2) G2
- (near XS2) G3
- (near XS2) G4
- (near XS2) R3
- (near XS2) R4
- (near XS2) R5
- (near XS2) R6
- (near XS2) R7
- (near XS2) R0
- (near XS2) R1
- (near XS2) R2
- (near XS2) PCLK
- (near XS2) L/R
- (near XS2) U/D
- (near XS2) VGH
- (near XS2) VGL
- (near XS2) AVDD
- (near XS2) RESET
- (near XS2) NC
- (near XS2) DITHB
- (near XS1) Цепь
- (near XS1) Конт
- X+
- Y-
- X-
- Y+
- Vcc
- (near XP1) SWDCLK
- (near XP1) SWDIO
- (near XP1) TRACESWO
- (near XP1) NRST
- (near XP1) GND
- BUS
- Подп. и дата
- Инв. № дубл.
- Взам. инв. №
- Инв. № подл.
- Изм.
- Лист
- № докум.
- Подп.
- Дата
- 2.106-A3
- Копировал
- Формат А3
- (in symbol M95640) PROM
- (in symbol microSD-8-CF) COMM/RESP; Clock; DL[Bit0]; DL[Bit1]; DL[Bit2]; CD/DL[Bit3]; Supp. Volt; GND
- (in symbol PCF8563_SOIC8) RTC
- (in symbol STMPE811QTR) A/D
- (in symbol СI1106М1V) Конт; Цепь

### Library data of the parts
BQ1 = 90SMX 32768: Manufacturer: QCU; Replacement: ABS25-32.768KHZ-T; PackageReference: 90SMX
BQ2 = TSX-3225: Manufacturer: EPSON; Replacement: TSX-3225 8.0000MF20X-AJ0-ND; PackageReference: TSX-3225; Part Number: TSX-3225 8.0000MF20X-AJ0-ND
C67-C69 C71 = Cap_0603: as C24 on sheet PLC1; PackageReference: 0603; Value: 0.01uF; Distributor: http://www.rospek.ru; Price: 0.001$
C70 = Cap_0603: Manufacturer: Yageo; Part Number: CC0603JRNPO9BN100; Replacement: 10pF 0603 NP0; PackageReference: 0603; Distributor: http://www.platan.ru/; Price: 0.02$
C72 C73 = Cap_0603: as C38 on sheet PLC1; PackageReference: 0603; Value: 0.1uF; Distributor: http://www.rospek.ru; Price: 0.001$
C74 C75 C77-C79 C82 C84-C86 C89-C97 = Cap_0603: as C6 on sheet PLC1; PackageReference: 0603; Value: 0.1uF; Distributor: http://www.rospek.ru; Price: 0.001$
C76 = Cap_0805: as C48 on sheet PLC1; PackageReference: 0805; Distributor: http://www.rospek.ru; Price: 0.01$
C80 = Cap_0603: as C26 on sheet PLC1; PackageReference: 0603; Distributor: http://www.platan.ru/; Price: 0.02$
C81 = Cap_0603: as C65 on sheet PLC1; PackageReference: 0603; Value: 1uF; Distributor: http://www.rospek.ru; Price: 0.001$
C83 = Cap_0603: Manufacturer: AVX; Replacement: 0603YD105KAT2A; PackageReference: 0603; Part Number: 0603YD105KAT2A; Value: 1uF; Distributor: http://www.rospek.ru; Price: 0.001$
C87 C88 = Cap_0603: Manufacturer: Murata; Part Number: GRM1885C1H180JA01D; Replacement: 18pF 0603 NP0; PackageReference: 0603; Distributor: http://www.rospek.ru; Price: 0.001$
DD1 = STM32F746ZG_176: MCU; Manufacturer: ST; Price: 0; Distributor: mouser; Replacement: STM32F746; PackageReference: LQFP144
DD2 = PCF8563_SOIC8: Manufacturer: NXP; Price: 0.3$; Replacement: PCF8563T/5; PackageReference: SO-8
DD3 = STMPE811QTR: Touchscreen controller; Manufacturer: S T; Price: 1$; Replacement: STMPE811QTR; PackageReference: QFN-16; Part Number: STMPE811QTR
DD4 = M95640: Manufacturer: ST; Replacement: M95640-RDW6TP; Price: 0.25$; Distributor: http://st.com; PackageReference: TSSOP-8
DD5 = MT48LC16M16A2TG: DRAM; Manufacturer: ST; Replacement: MT48LC16M16A2P-7E I; Price: 1$; Distributor: mouser; PackageReference: TSOP-54
GB1 = Battery_3V: Keystone - 1066; Part Number: Keystone - 1066; Price: 0.3$
R15-R17 R19 R21 R25-R27 R37 = Res_0402: 0402; Manufacturer: BOURNS; Part Number: CR0402-FX-1000GLF; Replacement: 0402 100 Ohm 5%; PackageReference: 0402; Distributor: http://www.kontest.ru; Price: 0.01$
R18 R28-R34 R39 R40 = Res_0603: as R2 on sheet PLC1; PackageReference: 0603; Value: 4,7k; Distributor: http://www.kontest.ru; Price: 0.01$
R20 = Res_0603: 0603, 390; Manufacturer: YAGEO; Part Number: RC0603FR-07390RL; Replacement: 0603 390 5%; PackageReference: 0603; Value: 390; Price: 0.004$
R22 = Res_0603: 0603, 15k; Manufacturer: Vishay; Part Number: CRCW060315K0JNTA; Replacement: 0603 15 kOhm 5%; PackageReference: 0603; Distributor: http://www.kontest.ru; Price: 0.01$; Value: 15к
R23 = Res_0603: 0603, 6.8k; Manufacturer: Vishay; Part Number: CRCW06036K80JNEA; Replacement: 0603 6.8 kOhm 5%; Value: 6.8к; PackageReference: 0603; Distributor: http://www.kontest.ru; Price: 0.01$
R24 = 3302X-3-103E: Manufacturer: Bourns; Part Number: 3302X-3-103E; Price: 0.42$
R35 R36 R38 = Res_0603: as R12 on sheet PLC1; PackageReference: 0603; Distributor: http://www.kontest.ru; Price: 0.01$; Value: 10k
R41-R45 = Res_0603: as R1 on sheet PLC1; PackageReference: 0603; Distributor: http://www.kontest.ru; Price: 0.01$
XP1 = СI1106М1V: CON 6pin СI1106М1V Гнездо Розетка; Montage: SMD; Contacts: 6; Contact_type: plug; Family: Connectror; Type: plug
XS1 = 100ZFS-RL-04: Manufacturer: RTC, TE; Value: 84952-4; Part Number: 84952-4; Replacement: 84952-4
XS2 = FB0.5-50: Manufacturer: RCT; Price: 1$; Part Number: MOLEX 	54104-5033; Replacement: MOLEX 	54104-5033; PackageReference: SMD-50
XS3 = microSD-8-CF: Part Number: microSD 8-CF; Replacement: microSD-8-CF; Price: 1$

## Sheet PLC1_3.SchDoc
size 420 x 297 mm; SheetNumber: 3; Scale: {Масш.}; Title1str: {Наименование}; PageSetup: Record=PageOptions|CenterHorizontal=False|CenterVertical=False|PrintScale=0.67|XCorrection=0.00|YCorrection=0.00|PrintKind=1|BorderSize=5000000|LeftOffset=0|BottomOffset=0|Orientation=2|PaperLength=1000|PaperWidth=1000|Scale=100|PaperSource=7|PrintQuality=600|MediaType=1|DitherType=10|PaperKind=A4|PrintScaleMode=1; Title2str: {Наименование}; ProcessInspection: {Т.контр.}; Mass: {Масса}; NormInspection: {Н.контр.}; EngineerName: {Инженер}; Letter1Column: {}; Letter2Column: {}; Letter3Column: {}; DocumentType: ?????????????? ?????; DocumentType1str: {Документ}; DocumentType2str: {Документ}
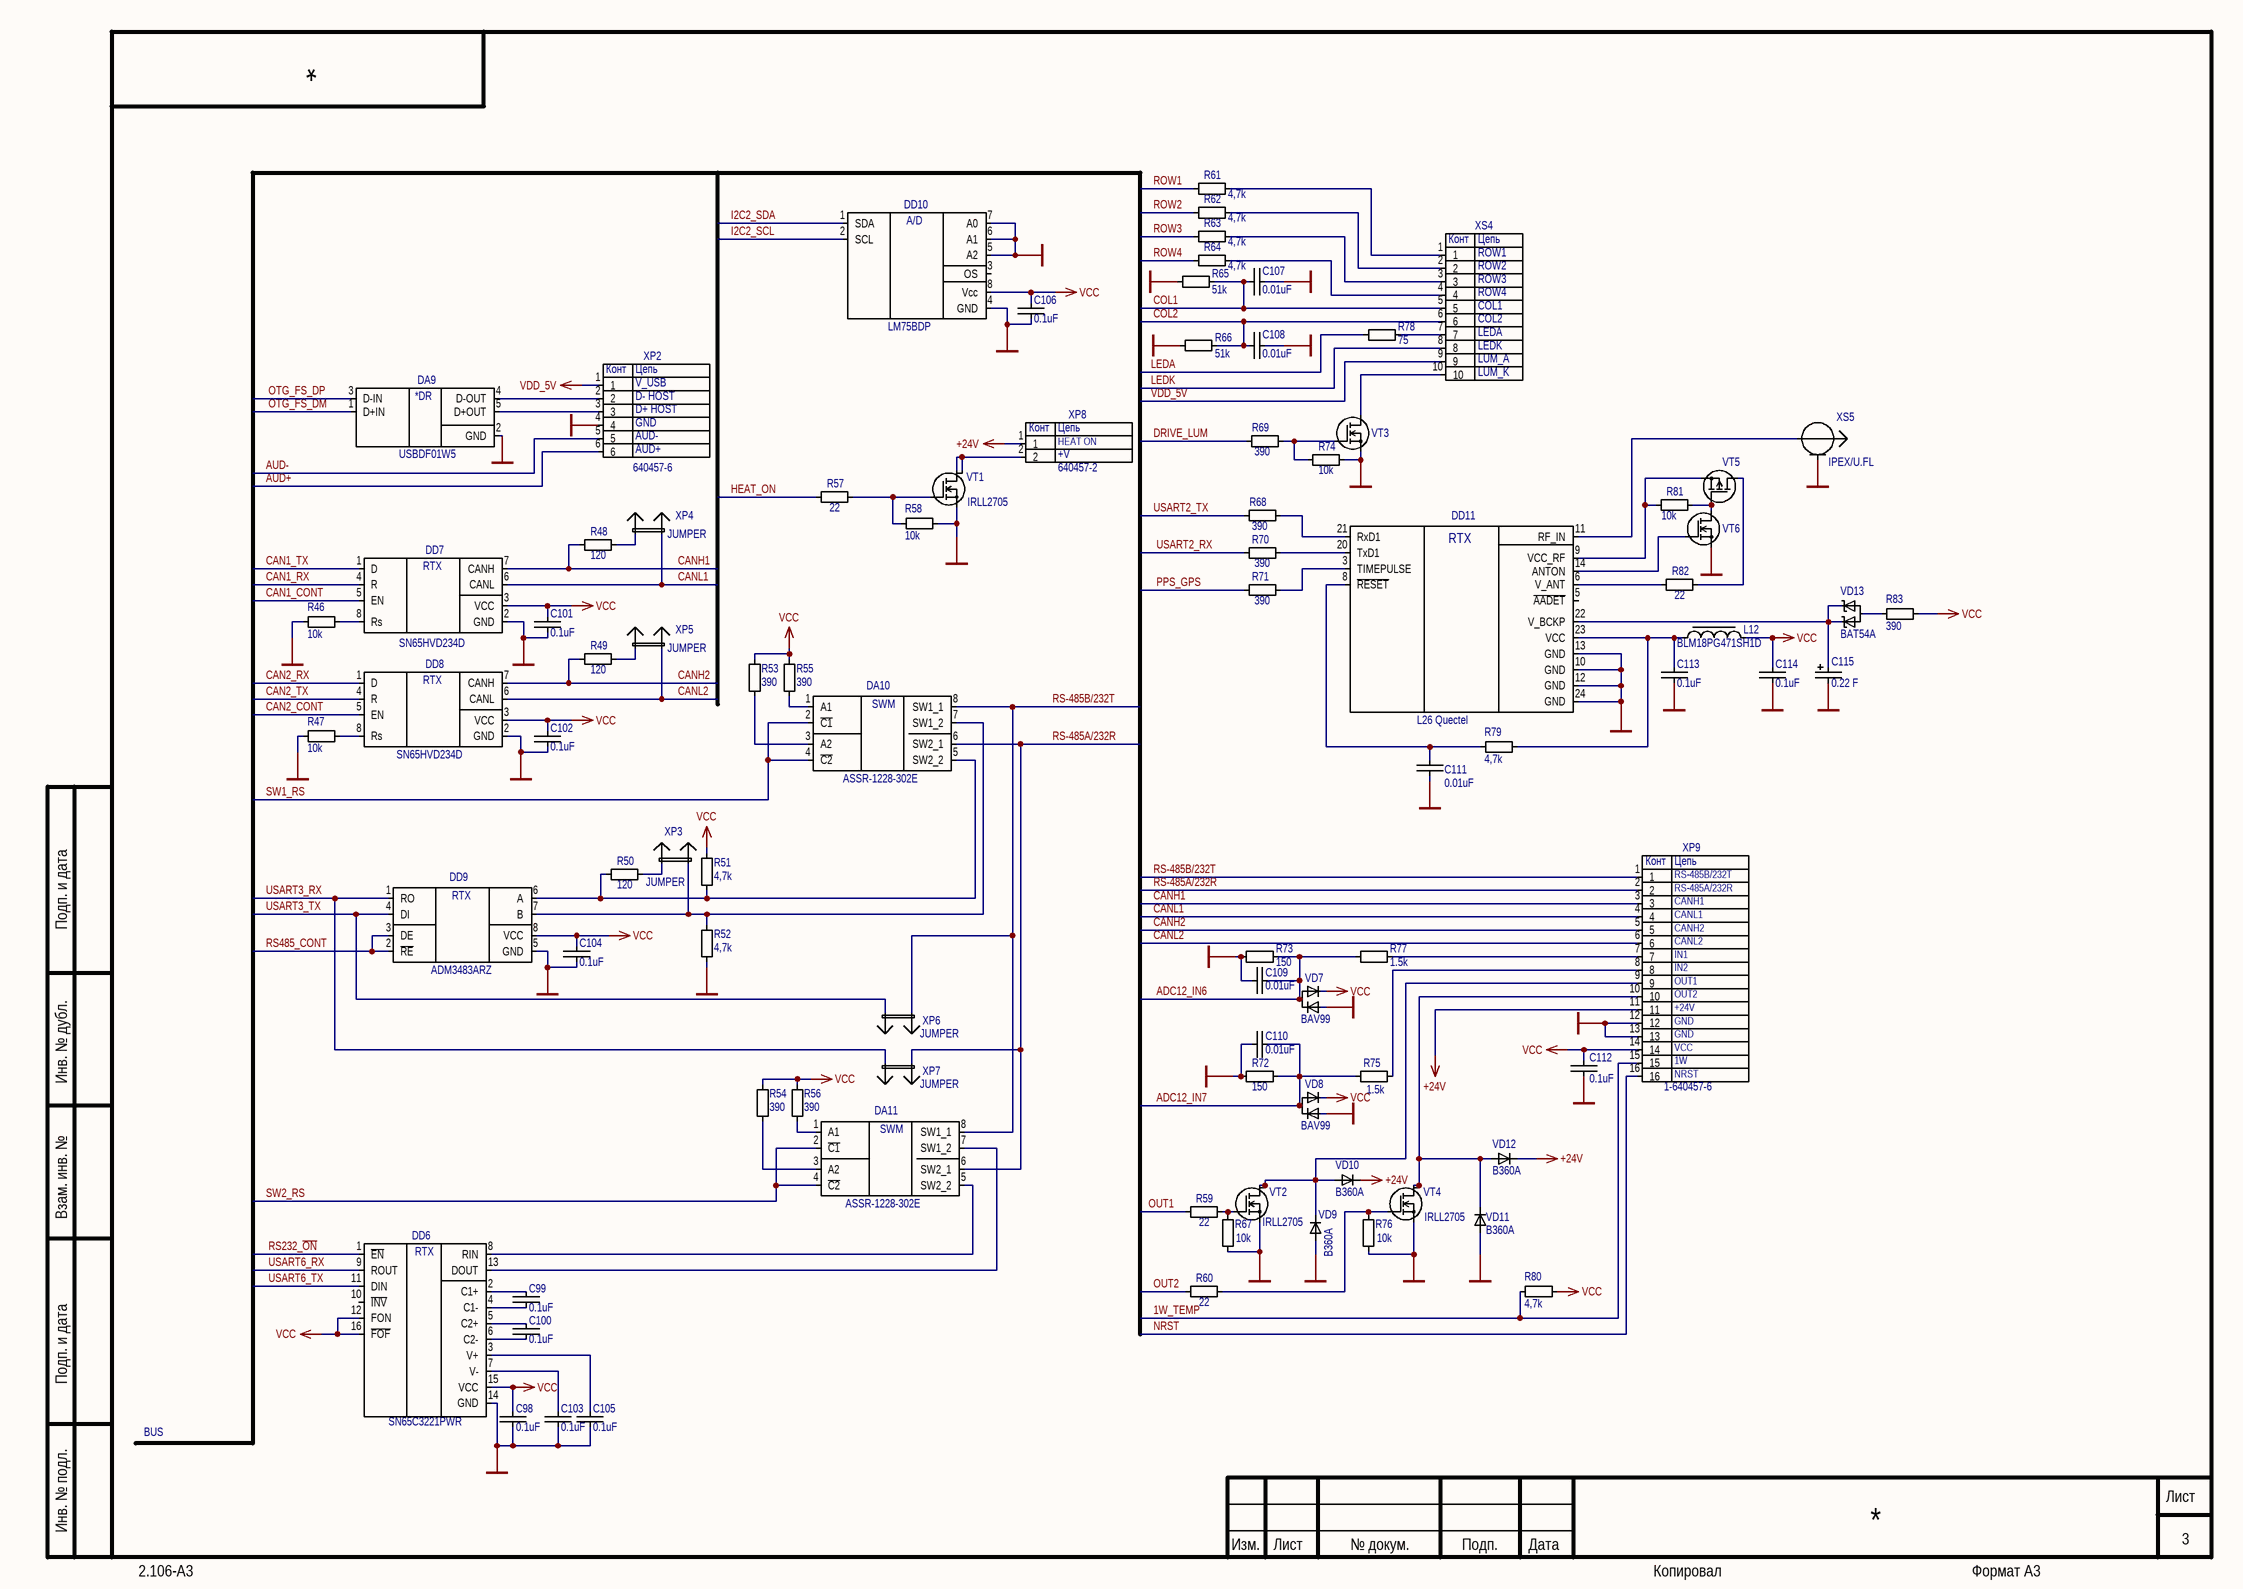
[diagram p2: PLC1_3.SchDoc]

### Parts
C98  0.1uF  [CAP_0603]
C99  0.1uF  [CAP_0603]
C100  0.1uF  [CAP_0603]
C101  0.1uF  [CAP_0603]
C102  0.1uF  [CAP_0603]
C103  0.1uF  [CAP_0603]
C104  0.1uF  [CAP_0603]
C105  0.1uF  [CAP_0603]
C106  0.1uF  [CAP_0603]
C107  0.01uF  [CAP_0603]
C108  0.01uF  [CAP_0603]
C109  0.01uF  [CAP_0603]
C110  0.01uF  [CAP_0603]
C111  0.01uF  [CAP_0603]
C112  0.1uF  [CAP_0603]
C113  0.1uF  [CAP_0603]
C114  0.1uF  [CAP_0603]
C115  0.22 F  [KR-5R5C104-R]
DA9  USBDF01W5  [SOT323-5L]
DA10  ASSR-1228-302E  [DIP8_GULL]
DA11  ASSR-1228-302E  [DIP8_GULL]
DD6  SN65C3221PWR  [TSSO5x6-G16]
DD7  SN65HVD234D  [SOIC8]
DD8  SN65HVD234D  [SOIC8]
DD9  Part Number: ADM3483ARZ  [SOIC8]  (hidden comment: ADM3483)
DD10  LM75BDP  [TSSO3x5-G8/X.4]
DD11  L26 Quectel  [VK1612U]
L12  BLM18PG471SH1D  [R_IND_0603]
R46  10k  [RES_0603]
R47  10k  [RES_0603]
R48  120  [Res_2010]
R49  120  [Res_2010]
R50  120  [Res_2010]
R51  4,7k  [RES_0603]
R52  4,7k  [RES_0603]
R53  390  [RES_0603]
R54  390  [RES_0603]
R55  390  [RES_0603]
R56  390  [RES_0603]
R57  22  [RES_0603]
R58  10k  [RES_0603]
R59  22  [RES_0603]
R60  22  [RES_0603]
R61  4,7k  [Res_0603]
R62  4,7k  [Res_0603]
R63  4,7k  [Res_0603]
R64  4,7k  [Res_0603]
R65  51k  [RES_0603]
R66  51k  [RES_0603]
R67  10k  [RES_0603]
R68  390  [RES_0603]
R69  390  [RES_0603]
R70  390  [RES_0603]
R71  390  [RES_0603]
R72  value 150  [Res_1206]  (hidden comment: Res_1206)
R73  value 150  [Res_1206]  (hidden comment: Res_1206)
R74  10k  [RES_0603]
R75  value 1.5k  [Res_1206]  (hidden comment: Res_1206)
R76  10k  [RES_0603]
R77  value 1.5k  [Res_1206]  (hidden comment: Res_1206)
R78  75  [RES_0603]
R79  4,7k  [Res_0603]
R80  4,7k  [Res_0603]
R81  10k  [RES_0603]
R82  22  [RES_0603]
R83  390  [RES_0603]
VD7  BAV99  [SOT-23]
VD8  BAV99  [SOT-23]
VD9  B360A  [DO-214AC]
VD10  B360A  [DO-214AC]
VD11  B360A  [DO-214AC]
VD12  B360A  [DO-214AC]
VD13  BAT54A  [SOT-23]
VT1  Part Number: IRLL2705  [SOT-223]  (hidden comment: N-CHAN_SOT-223)
VT2  Part Number: IRLL2705  [SOT-223]  (hidden comment: N-CHAN_SOT-223)
VT3  N-CHAN_SOT-23  [SOT-23]  (value not drawn)
VT4  Part Number: IRLL2705  [SOT-223]  (hidden comment: N-CHAN_SOT-223)
VT5  IRLML6402  [SOT-23]  (value not drawn)
VT6  N-CHAN_SOT-23  [SOT-23]  (value not drawn)
XP2  640457-6  [640457-6]
XP3  JUMPER  [PLS2-R]
XP4  JUMPER  [PLS2-R]
XP5  JUMPER  [PLS2-R]
XP6  JUMPER  [JMPTOPOLOGY]
XP7  JUMPER  [JMPTOPOLOGY]
XP8  640457-2  [640457-2]
XP9  1-640457-6  [1-640457-6]
XS4  522711079  [522711079]  (value not drawn)
XS5  IPEX/U.FL  [IPEX MHFI]

### Nets
+24V: VD10.2 VD12.2 XP8.1 XP9.11
GND: C98.2 C101.2 C102.2 C103.2 C104.2 C105.2 C106.2 C107.1 C108.1 C109.1 C110.1 C111.2 C112.2 C113.2 C114.2 C115.2 DA9.2(GND) DD6.14(GND) DD7.2(GND) DD8.2(GND) DD9.5(GND) DD10.4(GND) DD10.5(A2) DD10.6(A1) DD10.7(A0) DD11.10(GND) DD11.12(GND) DD11.13(GND) DD11.24(GND) R46.2 R47.2 R52.2 R58.1 R65.2 R66.2 R67.1 R72.2 R73.2 R74.1 R76.1 VD7.1 VD8.1 VD9.1 VD11.1 VT1.3 VT2.3 VT3.2 VT4.3 VT6.2 XP2.4 XP9.12 XP9.13 XS5.2
VCC: C98.1 C101.1 C102.1 C104.1 C106.1 C112.1 C114.1 DD6.12(FON) DD6.15(VCC) DD6.16(~{FOF}) DD7.3(VCC) DD8.3(VCC) DD9.8(VCC) DD10.8(Vcc) L12.1 R51.1 R53.1 R54.1 R55.1 R56.1 R80.1 R83.2 VD7.2 VD8.2 XP9.14
VDD_5V: XP2.1 XS4.9
1W_TEMP: R80.2 XP9.15
ADC12_IN6: C109.2 R73.1 R77.2 VD7.3
ADC12_IN7: C110.2 R72.1 R75.2 VD8.3
AUD+: XP2.6
AUD-: XP2.5
CAN1_CONT: DD7.5(EN)
CAN1_RX: DD7.4(R)
CAN1_TX: DD7.1(D)
CAN2_CONT: DD8.5(EN)
CAN2_RX: DD8.1(D)
CAN2_TX: DD8.4(R)
CANH1: DD7.7(CANH) R48.1 XP9.3
CANH2: DD8.7(CANH) R49.1 XP9.5
CANL1: DD7.6(CANL) XP4.2 XP9.4
CANL2: DD8.6(CANL) XP5.2 XP9.6
COL1: C107.2 R65.1 XS4.5
COL2: C108.2 R66.1 XS4.6
DRIVE_LUM: R69.1
HEAT_ON: R57.1
I2C2_SCL: DD10.2(SCL)
I2C2_SDA: DD10.1(SDA)
LEDA: R78.2
LEDK: XS4.8
NRST: XP9.16
OTG_FS_DM: DA9.1(D+IN)
OTG_FS_DP: DA9.3(D-IN)
OUT1: R59.1
OUT2: R60.1
PPS_GPS: R71.1
ROW1: R61.2
ROW2: R62.2
ROW3: R63.2
ROW4: R64.2
RS232_~{ON}: DD6.1(~{EN})
RS485_CONT: DD9.2(~{RE}) DD9.3(DE)
RS-485A/232R: DA10.6(SW2_1) DA11.6(SW2_1) XP7.1 XP9.2
RS-485B/232T: DA10.8(SW1_1) DA11.8(SW1_1) XP6.1 XP9.1
SW1_RS: DA10.2(~{C1}) DA10.4(~{C2})
SW2_RS: DA11.2(~{C1}) DA11.4(~{C2})
USART2_RX: R70.1
USART2_TX: R68.1
USART3_RX: DD9.1(RO) XP7.2
USART3_TX: DD9.4(DI) XP6.2
USART6_RX: DD6.9(ROUT)
USART6_TX: DD6.11(DIN)
NetC99_1: C99.1 DD6.2(C1+)
NetC99_2: C99.2 DD6.4(C1-)
NetC100_1: C100.1 DD6.5(C2+)
NetC100_2: C100.2 DD6.6(C2-)
NetC103_1: C103.1 DD6.7(V-)
NetC105_1: C105.1 DD6.3(V+)
NetC111_1: C111.1 DD11.8(~{RESET}) R79.2
NetC113_1: C113.1 DD11.23(VCC) L12.2 R79.1
NetC115_1: C115.1 DD11.22(V_BCKP) VD13.1 VD13.2
NetDA9_4: DA9.4(D-OUT) XP2.2
NetDA9_5: DA9.5(D+OUT) XP2.3
NetDA10_1: DA10.1(A1) R55.2
NetDA10_3: DA10.3(A2) R53.2
NetDA10_5: DA10.5(SW2_2) DD9.6(A) R50.1 R51.2
NetDA10_7: DA10.7(SW1_2) DD9.7(B) R52.1 XP3.2
NetDA11_1: DA11.1(A1) R56.2
NetDA11_3: DA11.3(A2) R54.2
NetDA11_5: DA11.5(SW2_2) DD6.8(RIN)
NetDA11_7: DA11.7(SW1_2) DD6.13(DOUT)
NetDD7_8: DD7.8(Rs) R46.1
NetDD8_8: DD8.8(Rs) R47.1
NetDD11_3: DD11.3(TIMEPULSE) R71.2
NetDD11_6: DD11.6(V_ANT) R82.1
NetDD11_9: DD11.9(VCC_RF) R81.2 VT5.2
NetDD11_11: DD11.11(RF_IN) XS5.1
NetDD11_14: DD11.14(ANTON) VT6.1
NetDD11_20: DD11.20(TxD1) R70.2
NetDD11_21: DD11.21(RxD1) R68.2
NetR48_2: R48.2 XP4.1
NetR49_2: R49.2 XP5.1
NetR50_2: R50.2 XP3.1
NetR57_2: R57.2 R58.2 VT1.1
NetR59_2: R59.2 R67.2 VT2.1
NetR60_2: R60.2 R76.2 VT4.1
NetR61_1: R61.1 XS4.1
NetR62_1: R62.1 XS4.2
NetR63_1: R63.1 XS4.3
NetR64_1: R64.1 XS4.4
NetR69_2: R69.2 R74.2 VT3.1
NetR75_1: R75.1 XP9.8
NetR77_1: R77.1 XP9.7
NetR78_1: R78.1 XS4.7
NetR81_1: R81.1 VT5.1 VT6.3
NetR82_2: R82.2 VT5.3
NetR83_1: R83.1 VD13.3
NetVD9_2: VD9.2 VD10.1 VT2.2 VT2.4 XP9.9
NetVD11_2: VD11.2 VD12.1 VT4.2 VT4.4 XP9.10
NetVT1_2: VT1.2 VT1.4 XP8.2
NetVT3_3: VT3.3 XS4.10

Not connected (* = marked no-connect by the designer): DD6 10(~{INV}); DD10 3(OS); DD11 5(~{AADET})

### Notes on the sheet
- (near XS4) ROW1
- (near XS4) ROW2
- (near XS4) ROW3
- (near XS4) ROW4
- (near XS4) COL1
- (near XS4) COL2
- (near XP2) Конт
- (near XP2) V_USB
- (near XP2) Цепь
- (near XS4) LEDA
- (near XS4) LEDK
- (near XS4) LUM_A
- (near XS4) LUM_K
- (near XP2) D+ HOST
- (near XP2) D- HOST
- (near XP2) GND
- (near XP2) AUD-
- (near XP2) AUD+
- (near XP8) Конт
- (near XP8) Цепь
- (near XP8) HEAT ON
- (near XP8) +V
- (near XP9) Конт
- (near XP9) Цепь
- (near XP9) RS-485B/232T
- (near XP9) RS-485A/232R
- (near XP9) CANH1
- (near XP9) CANL1
- (near XP9) CANH2
- (near XP9) CANL2
- (near XP9) IN1
- (near XP9) IN2
- (near XP9) OUT1
- (near XP9) OUT2
- (near XP9) +24V
- (near XP9) GND
- (near XP9) 1W
- (near XP9) VCC
- (near XP9) NRST
- BUS
- Подп. и дата
- Инв. № дубл.
- Взам. инв. №
- Инв. № подл.
- Изм.
- Лист
- № докум.
- Подп.
- Дата
- 2.106-A3
- Копировал
- Формат А3
- (in symbol 522711079) Конт; Цепь
- (in symbol ADM3483) RTX
- (in symbol ASSR-1228-302E) SWM
- (in symbol L26 Quectel) RTX
- (in symbol LM75BDP) A/D
- (in symbol SN65C3221PWR) RTX
- (in symbol SN65HVD234D) RTX
- (in symbol USBDF01W6) *DR

### Library data of the parts
C98-C106 C112-C114 = Cap_0603: as C6 on sheet PLC1; PackageReference: 0603; Value: 0.1uF; Distributor: http://www.rospek.ru; Price: 0.001$
C107-C111 = Cap_0603: as C24 on sheet PLC1; PackageReference: 0603; Value: 0.01uF; Distributor: http://www.rospek.ru; Price: 0.001$
C115 = KR-5R5C104-R: supercapacitor 0.22 uF; Manufacturer: Panasonic; Replacement: KR-5R5C224-R; Value: 0.1F; PackageReference: AXIAL 10; Part Number: KR-5R5C224-R; Distributor: panasonic.com; Price: 0.6$
DA9 = USBDF01W6: Unidirectional 2 lines Filter + ESD; Manufacturer: ST; Replacement: USBDF02W5; Price: 0.5$; Distributor: http://st.com; PackageReference: SOT-323-5; Part Number: USBDF01W5
DA10 DA11 = ASSR-1228-302E: RS-485 PHY; Manufacturer: AVAGO; Price: 2.1$; Distributor: http://www.avagotech.com; Value: ASSR-1228-302E; Replacement: ASSR-1228-302E; PackageReference: PDIP-8 GULL; Part Number: ASSR-1228-302E
DD6 = SN65C3221PWR: RS-232 PHY CAN PHY; Manufacturer: TI; Replacement: SP3221E EXAR; Price: 1.05$; Distributor: http://ti.com; PackageReference: TSSOP-16; Part Number: SN65C3221PWR
DD7 DD8 = SN65HVD234D: SN65HVD234D CAN PHY; Manufacturer: TI; Price: 1.5$; Distributor: http://ti.com; Replacement: SN65HVD234D; PackageReference: SO-8; Part Number: SN65HVD234D
DD9 = ADM3483: RS-485 PHY; Manufacturer: Analog Devices; Price: 1.1$; Distributor: http://analog.com; Replacement: ADM3483ARZ; PackageReference: SO-8 narrow
DD10 = LM75BDP: LM75BDP TEMPERATURE SENSOR; Manufacturer: NXP; Price: 0.4$; Distributor: http://nxp.com; Replacement: LM75BDP; PackageReference: TSSOP; Part Number: LM75BDP
DD11 = L26 Quectel: GPS receiver; Price: 8$; Replacement: L26 Quectel; PackageReference: LLC 24; Manufacturer: Quectel; Part Number: L26 Quectel
L12 = FCM1608KF-601T03: as L5 on sheet PLC1; PackageReference: 0603; Part Number: BLM18PG471SH1D; Distributor: http://www.chipdip.ru; Price: 0.1$; Value: BLM18PG471SH1D
R46 R47 R58 R67 R74 R76 R81 = Res_0603: as R12 on sheet PLC1; PackageReference: 0603; Distributor: http://www.kontest.ru; Price: 0.01$; Value: 10k
R48-R50 = Res_2010: 2010; Manufacturer: NIC Components Corp.; Part Number: NRC50J121TRF; PackageReference: 2010; Value: 120; Price: 0.1$
R51 R52 R61-R64 R79 R80 = Res_0603: as R2 on sheet PLC1; PackageReference: 0603; Value: 4,7k; Distributor: http://www.kontest.ru; Price: 0.01$
R53-R56 R68-R71 R83 = Res_0603: as R20 on sheet PLC1_2; PackageReference: 0603; Value: 390; Price: 0.004$
R57 R59 R60 R82 = Res_0603: 0603, 22; Manufacturer: Vishay; Part Number: CRCW020122R0JNED; Replacement: 0603 22 Ohm 5%; PackageReference: 0603; Distributor: http://www.kontest.ru; Price: 0.01$; Value: 22
R65 R66 = Res_0603: as R1 on sheet PLC1; PackageReference: 0603; Distributor: http://www.kontest.ru; Price: 0.01$
R72 R73 = Res_1206: Manufacturer: Vishay; Part Number: CRCW1206150RFKEA; Replacement: 150 Ohm 1%; PackageReference: 1206; Price: 0.1$
R75 R77 = Res_1206: Manufacturer: Vishay; Part Number: CRCW12061K50FKEA; Replacement: 1.5 kOhm 1%; PackageReference: 1206; Price: 0.1$
R78 = Res_0603: 0603; Manufacturer: YAGEO; Part Number: RC0603JR-0775RL; Replacement: 0603 75 Ohm 5%; PackageReference: 0603; Distributor: http://www.kontest.ru; Price: 0.01$; Value: 75
VD7 VD8 = BAV99: Manufacturer: Fairchild; Distributor: Fairchild; Part Number: BAV99
VD9-VD12 = S1A: Manufacturer: VISHAY; Price: 3; Distributor: http://www.chipdip.ru/; Part Number: B360A; PackageReference: DO-214AC
VT3 VT6 = N-CHAN_SOT-23: Manufacturer: IR; Part Number: IRLML2502; Replacement: IRLML2402; PackageReference: SOT-23
VT5 = P-CHAN_SOT-23: Part Number: IRLML6402
XP2 = 640457-6: Manufacturer: TE; Price: 0.19$; Part Number: 640457-6
XP3-XP5 = PLS-2 R: JUMPER 2.54; Manufacturer: TE; Part Number: PLS-2R; Distributor: www.brownbear.ru; Price: 0.05$
XP6 XP7 = TOPOLOGYJMP: JUMPER 2.54; Manufacturer: TE; Value: JMP; Price: 0.05$
XP8 = 640457-2: Manufacturer: TE; Price: 0.11; Distributor: digikey; Part Number: 640457-2
XP9 = 1-640457-6: Manufacturer: TE; Distributor: digikey; Part Number: 1-640457-6
XS4 = 522711079: Manufacturer: Molex; Price: 0.8$; Value: 522711079; Part Number: 522711079
XS5 = IPEX/U.FL: IPEX/U.FL male pcb SMT; Manufacturer: taoglas limited; Part Number: 20279-001E-01; Replacement: J983TR-ND; PackageReference: IPEX/U.FL
VD13 = BAT54A: Part Number: BAT54A
VT1 VT2 VT4 = N-CHAN_SOT-223: PackageReference: SOT-223 TO-261AA

## Sheet PLC1_4.SchDoc
size 420 x 297 mm; SheetNumber: 4; Scale: {Масш.}; Title1str: {Наименование}; PageSetup: Record=PageOptions|CenterHorizontal=False|CenterVertical=False|PrintScale=0.67|XCorrection=0.00|YCorrection=0.00|PrintKind=1|BorderSize=5000000|LeftOffset=0|BottomOffset=0|Orientation=2|PaperLength=1000|PaperWidth=1000|Scale=100|PaperSource=7|PrintQuality=600|MediaType=1|DitherType=10|PaperKind=A4|PrintScaleMode=1; Title2str: {Наименование}; ProcessInspection: {Т.контр.}; Mass: {Масса}; NormInspection: {Н.контр.}; EngineerName: {Инженер}; Letter1Column: {}; Letter2Column: {}; Letter3Column: {}; DocumentType: ?????????????? ?????; DocumentType1str: {Документ}; DocumentType2str: {Документ}
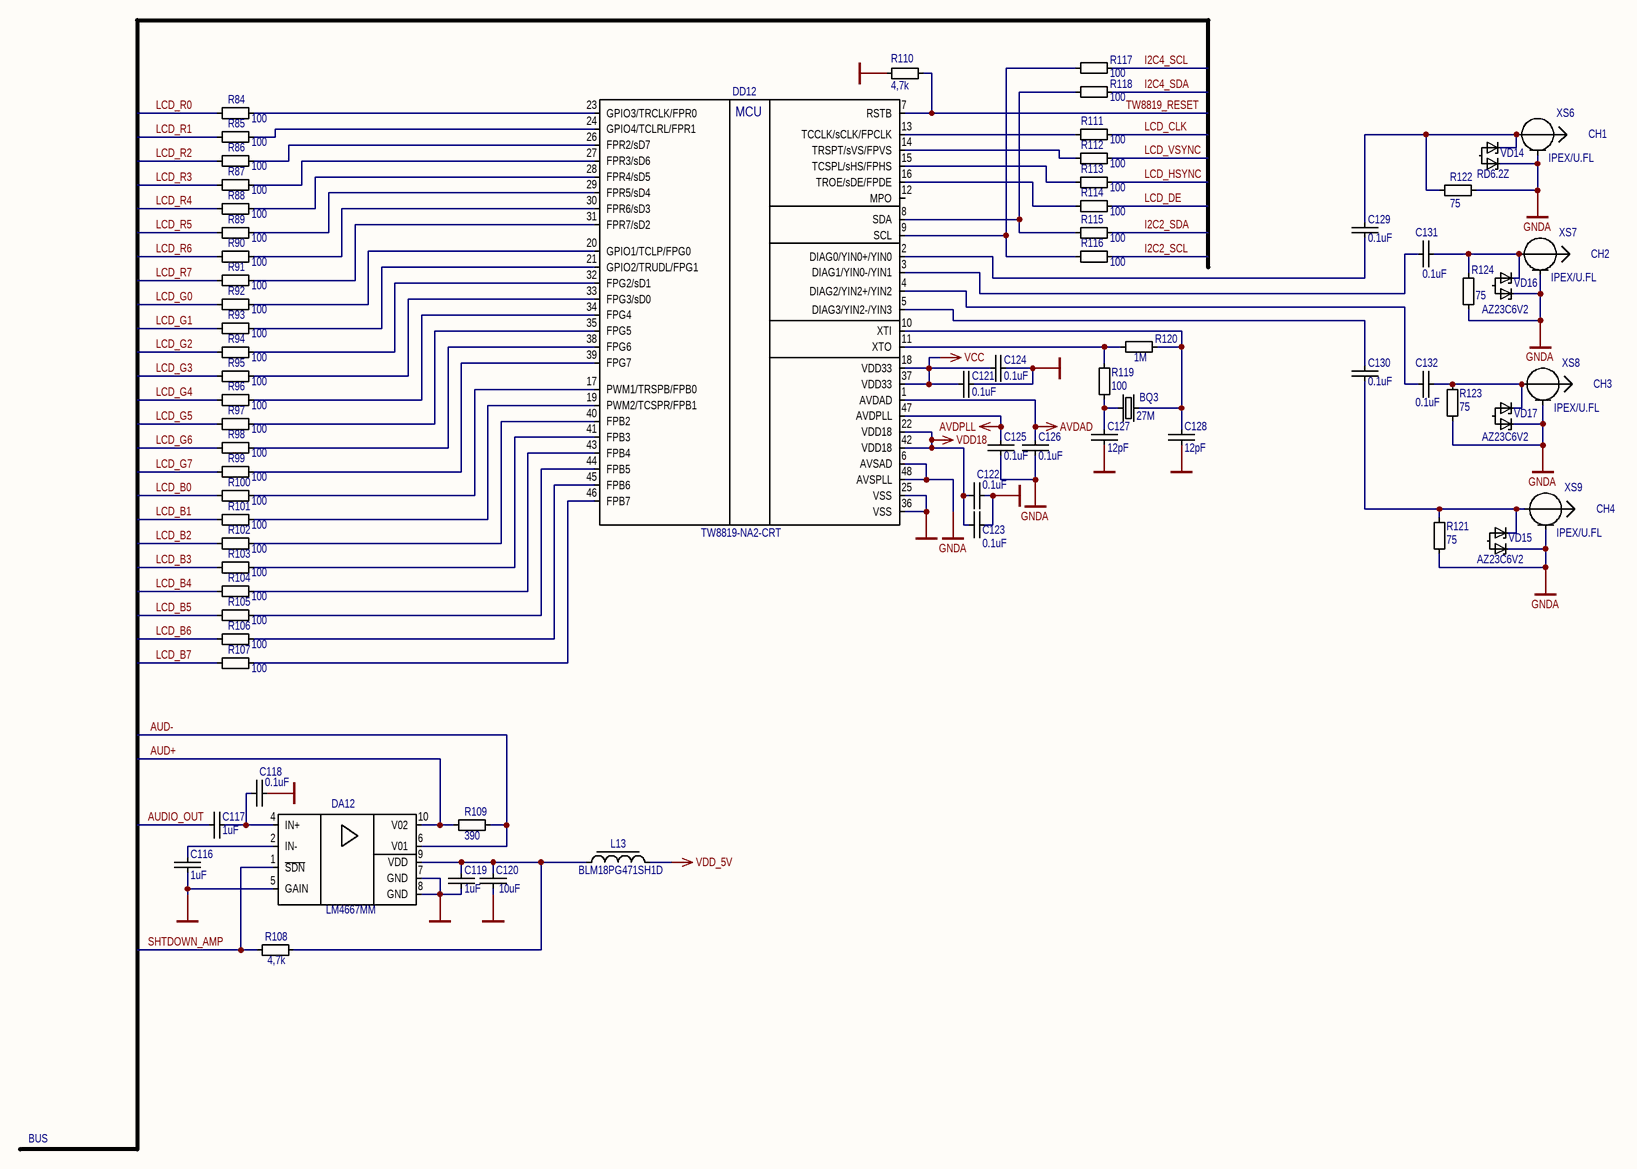
[diagram p3: PLC1_4.SchDoc]

### Parts
BQ3  value 27M  [TSX-3225]  (hidden comment: TSX-3225)
C116  1uF  [CAP_0603]
C117  1uF  [CAP_0603]
C118  0.1uF  [CAP_0603]
C119  1uF  [CAP_0603]
C120  10uF  [C_0805]
C121  0.1uF  [CAP_0603]
C122  0.1uF  [CAP_0603]
C123  0.1uF  [CAP_0603]
C124  0.1uF  [CAP_0603]
C125  0.1uF  [CAP_0603]
C126  0.1uF  [CAP_0603]
C127  12pF  [CAP_0603]
C128  12pF  [CAP_0603]
C129  0.1uF  [CAP_0603]
C130  0.1uF  [CAP_0603]
C131  0.1uF  [CAP_0603]
C132  0.1uF  [CAP_0603]
DA12  value LM4667MM  [S-PDSO-G10]  (hidden comment: LM4667MM/NOPB)
DD12  TW8819-NA2-CRT  [QFN48.7x7]
L13  BLM18PG471SH1D  [R_IND_0603]
R84  value 100  [RES_0402]  (hidden comment: Res_0402)
R85  value 100  [RES_0402]  (hidden comment: Res_0402)
R86  value 100  [RES_0402]  (hidden comment: Res_0402)
R87  value 100  [RES_0402]  (hidden comment: Res_0402)
R88  value 100  [RES_0402]  (hidden comment: Res_0402)
R89  value 100  [RES_0402]  (hidden comment: Res_0402)
R90  value 100  [RES_0402]  (hidden comment: Res_0402)
R91  value 100  [RES_0402]  (hidden comment: Res_0402)
R92  value 100  [RES_0402]  (hidden comment: Res_0402)
R93  value 100  [RES_0402]  (hidden comment: Res_0402)
R94  value 100  [RES_0402]  (hidden comment: Res_0402)
R95  value 100  [RES_0402]  (hidden comment: Res_0402)
R96  value 100  [RES_0402]  (hidden comment: Res_0402)
R97  value 100  [RES_0402]  (hidden comment: Res_0402)
R98  value 100  [RES_0402]  (hidden comment: Res_0402)
R99  value 100  [RES_0402]  (hidden comment: Res_0402)
R100  value 100  [RES_0402]  (hidden comment: Res_0402)
R101  value 100  [RES_0402]  (hidden comment: Res_0402)
R102  value 100  [RES_0402]  (hidden comment: Res_0402)
R103  value 100  [RES_0402]  (hidden comment: Res_0402)
R104  value 100  [RES_0402]  (hidden comment: Res_0402)
R105  value 100  [RES_0402]  (hidden comment: Res_0402)
R106  value 100  [RES_0402]  (hidden comment: Res_0402)
R107  value 100  [RES_0402]  (hidden comment: Res_0402)
R108  4,7k  [RES_0603]
R109  390  [RES_0603]
R110  4,7k  [RES_0603]
R111  value 100  [RES_0402]  (hidden comment: Res_0402)
R112  value 100  [RES_0402]  (hidden comment: Res_0402)
R113  value 100  [RES_0402]  (hidden comment: Res_0402)
R114  value 100  [RES_0402]  (hidden comment: Res_0402)
R115  value 100  [RES_0402]  (hidden comment: Res_0402)
R116  value 100  [RES_0402]  (hidden comment: Res_0402)
R117  value 100  [RES_0402]  (hidden comment: Res_0402)
R118  value 100  [RES_0402]  (hidden comment: Res_0402)
R119  value 100  [RES_0402]  (hidden comment: Res_0402)
R120  value 1M  [RES_0402]  (hidden comment: Res_0402)
R121  75  [RES_0603]
R122  75  [RES_0603]
R123  75  [RES_0603]
R124  75  [RES_0603]
VD14  RD6.2Z  [SC-59]
VD15  Part Number: AZ23C6V2  [SC-59]  (hidden comment: RD6.2Z)
VD16  Part Number: AZ23C6V2  [SC-59]  (hidden comment: RD6.2Z)
VD17  Part Number: AZ23C6V2  [SC-59]  (hidden comment: RD6.2Z)
XS6  IPEX/U.FL  [IPEX MHFI]
XS7  IPEX/U.FL  [IPEX MHFI]
XS8  IPEX/U.FL  [IPEX MHFI]
XS9  IPEX/U.FL  [IPEX MHFI]

### Nets
AVDAD: C126.1 DD12.1(AVDAD)
AVDPLL: C125.1 DD12.47(AVDPLL)
GND: C116.1 C118.2 C119.1 C120.1 C121.2 C122.2 C123.2 C124.2 C127.1 C128.1 DA12.5(GAIN) DA12.7(GND) DA12.8(GND) DD12.25(VSS) DD12.36(VSS) R110.2
GNDA: C125.2 C126.2 DD12.6(AVSAD) DD12.48(AVSPLL) R121.1 R122.2 R123.1 R124.2 VD14.2 VD15.2 VD16.2 VD17.2 XS6.2 XS7.2 XS8.2 XS9.2
VCC: C121.1 C124.1 DD12.18(VDD33) DD12.37(VDD33)
VDD18: C122.1 C123.1 DD12.22(VDD18) DD12.42(VDD18)
VDD_5V: L13.1
AUD+: DA12.10(V02) R109.2
AUD-: DA12.6(V01) R109.1
AUDIO_OUT: C117.2
I2C2_SCL: R116.2
I2C2_SDA: R115.2
I2C4_SCL: R117.2
I2C4_SDA: R118.2
LCD_B0: R100.2
LCD_B1: R101.2
LCD_B2: R102.2
LCD_B3: R103.2
LCD_B4: R104.2
LCD_B5: R105.2
LCD_B6: R106.2
LCD_B7: R107.2
LCD_CLK: R111.2
LCD_DE: R114.2
LCD_G0: R92.2
LCD_G1: R93.2
LCD_G2: R94.2
LCD_G3: R95.2
LCD_G4: R96.2
LCD_G5: R97.2
LCD_G6: R98.2
LCD_G7: R99.2
LCD_HSYNC: R113.2
LCD_R0: R84.2
LCD_R1: R85.2
LCD_R2: R86.2
LCD_R3: R87.2
LCD_R4: R88.2
LCD_R5: R89.2
LCD_R6: R90.2
LCD_R7: R91.2
LCD_VSYNC: R112.2
SHTDOWN_AMP: DA12.1(~{SDN}) R108.1
TW8819_RESET: DD12.7(RSTB) R110.1
NetBQ3_1: BQ3.1 C128.2 DD12.10(XTI) R120.1
NetBQ3_2: BQ3.2 C127.2 R119.1
NetC116_2: C116.2 DA12.2(IN-)
NetC117_1: C117.1 C118.1 DA12.4(IN+)
NetC119_2: C119.2 C120.2 DA12.9(VDD) L13.2 R108.2
NetC129_1: C129.1 R122.1 VD14.1 XS6.1
NetC129_2: C129.2 DD12.2(DIAG0/YIN0+/YIN0)
NetC130_1: C130.1 DD12.5(DIAG3/YIN2-/YIN3)
NetC130_2: C130.2 R121.2 VD15.1 XS9.1
NetC131_1: C131.1 DD12.3(DIAG1/YIN0-/YIN1)
NetC131_2: C131.2 R124.1 VD16.1 XS7.1
NetC132_1: C132.1 DD12.4(DIAG2/YIN2+/YIN2)
NetC132_2: C132.2 R123.2 VD17.1 XS8.1
NetDD12_8: DD12.8(SDA) R115.1 R118.1
NetDD12_9: DD12.9(SCL) R116.1 R117.1
NetDD12_11: DD12.11(XTO) R119.2 R120.2
NetDD12_13: DD12.13(TCCLK/sCLK/FPCLK) R111.1
NetDD12_14: DD12.14(TRSPT/sVS/FPVS) R112.1
NetDD12_15: DD12.15(TCSPL/sHS/FPHS) R113.1
NetDD12_16: DD12.16(TROE/sDE/FPDE) R114.1
NetDD12_17: DD12.17(PWM1/TRSPB/FPB0) R100.1
NetDD12_19: DD12.19(PWM2/TCSPR/FPB1) R101.1
NetDD12_20: DD12.20(GPIO1/TCLP/FPG0) R92.1
NetDD12_21: DD12.21(GPIO2/TRUDL/FPG1) R93.1
NetDD12_23: DD12.23(GPIO3/TRCLK/FPR0) R84.1
NetDD12_24: DD12.24(GPIO4/TCLRL/FPR1) R85.1
NetDD12_26: DD12.26(FPR2/sD7) R86.1
NetDD12_27: DD12.27(FPR3/sD6) R87.1
NetDD12_28: DD12.28(FPR4/sD5) R88.1
NetDD12_29: DD12.29(FPR5/sD4) R89.1
NetDD12_30: DD12.30(FPR6/sD3) R90.1
NetDD12_31: DD12.31(FPR7/sD2) R91.1
NetDD12_32: DD12.32(FPG2/sD1) R94.1
NetDD12_33: DD12.33(FPG3/sD0) R95.1
NetDD12_34: DD12.34(FPG4) R96.1
NetDD12_35: DD12.35(FPG5) R97.1
NetDD12_38: DD12.38(FPG6) R98.1
NetDD12_39: DD12.39(FPG7) R99.1
NetDD12_40: DD12.40(FPB2) R102.1
NetDD12_41: DD12.41(FPB3) R103.1
NetDD12_43: DD12.43(FPB4) R104.1
NetDD12_44: DD12.44(FPB5) R105.1
NetDD12_45: DD12.45(FPB6) R106.1
NetDD12_46: DD12.46(FPB7) R107.1

Not connected (* = marked no-connect by the designer): DD12 12(MPO); VD14 3; VD15 3; VD16 3; VD17 3

### Notes on the sheet
- (near XS6) CH1
- (near XS7) CH2
- (near XS8) CH3
- (near XS9) CH4
- BUS
- Подп. и дата
- Инв. № дубл.
- Взам. инв. №
- Инв. № подл.
- Изм.
- Лист
- № докум.
- Подп.
- Дата
- 2.106-A3
- Копировал
- Формат А3
- (in symbol TW8819-NA2-CRT) MCU

### Library data of the parts
BQ3 = TSX-3225: Manufacturer: EPSON; Part Number: EPSON TSX-3225 27.0000MF10Z-K3; Replacement: TSX-3225 27.0000MF10Z-AC0-ND; PackageReference: TSX-3225
C116 C117 C119 = Cap_0603: as C65 on sheet PLC1; PackageReference: 0603; Value: 1uF; Distributor: http://www.rospek.ru; Price: 0.001$
C118 C121-C126 C129-C132 = Cap_0603: as C6 on sheet PLC1; PackageReference: 0603; Value: 0.1uF; Distributor: http://www.rospek.ru; Price: 0.001$
C120 = Cap_0805: as C48 on sheet PLC1; PackageReference: 0805; Value: 10uF; Price: 0.01$
C127 C128 = Cap_0603: Manufacturer: Murata; Part Number: GRM1885C1H120JA01D; Replacement: 12pF 0603 NP0; PackageReference: 0603; Value: 12pF; Distributor: http://www.rospek.ru; Price: 0.001$
DA12 = LM4667MM/NOPB: Manufacturer: TEXAS INSTRUMENTS; Price: 0.6$; Distributor: TE; Replacement: LM4667MM/NOPB; PackageReference: VSSOP-10; Part Number: LM4667MM/NOPB
DD12 = TW8819-NA2-CRT: Manufacturer: Intersil; Price: 4.00$; Replacement: TW8819-NA2-CRT; PackageReference: WFQFN; TW8819-NA2-CRT: TW8819-NA2-CRT; Type: power
L13 = FCM1608KF-601T03: as L5 on sheet PLC1; PackageReference: 0603; Part Number: BLM18PG471SH1D; Distributor: http://www.chipdip.ru; Price: 0.1$; Value: BLM18PG471SH1D
R84-R107 R111-R119 = Res_0402: as R15 on sheet PLC1_2; PackageReference: 0402; Distributor: http://www.kontest.ru; Price: 0.01$
R108 R110 = Res_0603: as R2 on sheet PLC1; PackageReference: 0603; Value: 4,7k; Distributor: http://www.kontest.ru; Price: 0.01$
R109 = Res_0603: as R20 on sheet PLC1_2; PackageReference: 0603; Value: 390; Price: 0.004$
R120 = Res_0402: 0402; Manufacturer: BOURNS; Part Number: RC0402JR-071ML; Replacement: 0402 1 MOhm 5%; PackageReference: 0402; Distributor: http://www.kontest.ru; Price: 0.01$
R121-R124 = Res_0603: as R78 on sheet PLC1_3; PackageReference: 0603; Distributor: http://www.kontest.ru; Price: 0.01$; Value: 75
VD14-VD17 = RD6.2Z: Manufacturer: NEC; Price: 0.1$
  VD14: Part Number: RD6.2Z
  VD15-VD17: Replacement: RD6.2Z
XS6-XS9 = IPEX/U.FL: as XS5 on sheet PLC1_3; PackageReference: IPEX/U.FL